# EAGLE design CrackberryPi_1.0.6.3 (EAGLE 7.2.0)
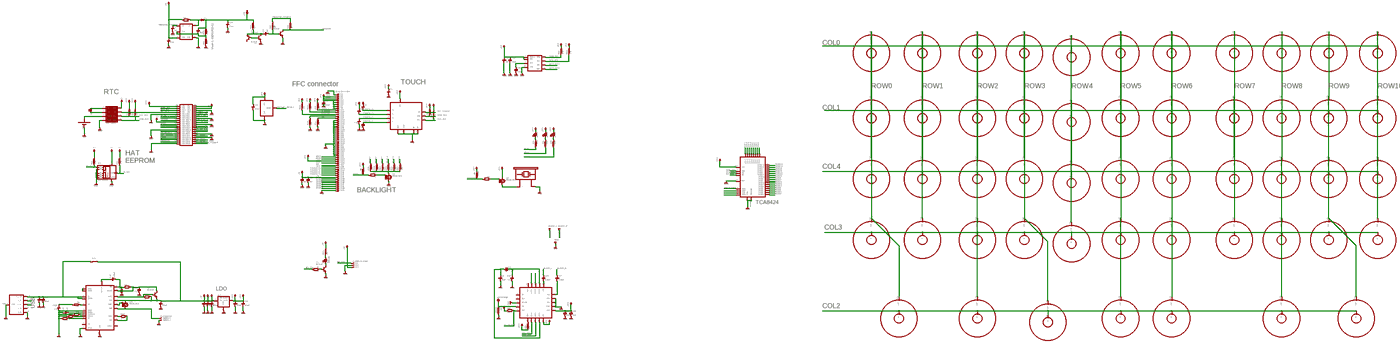
[diagram p0: schematic, sheet 1, overview]
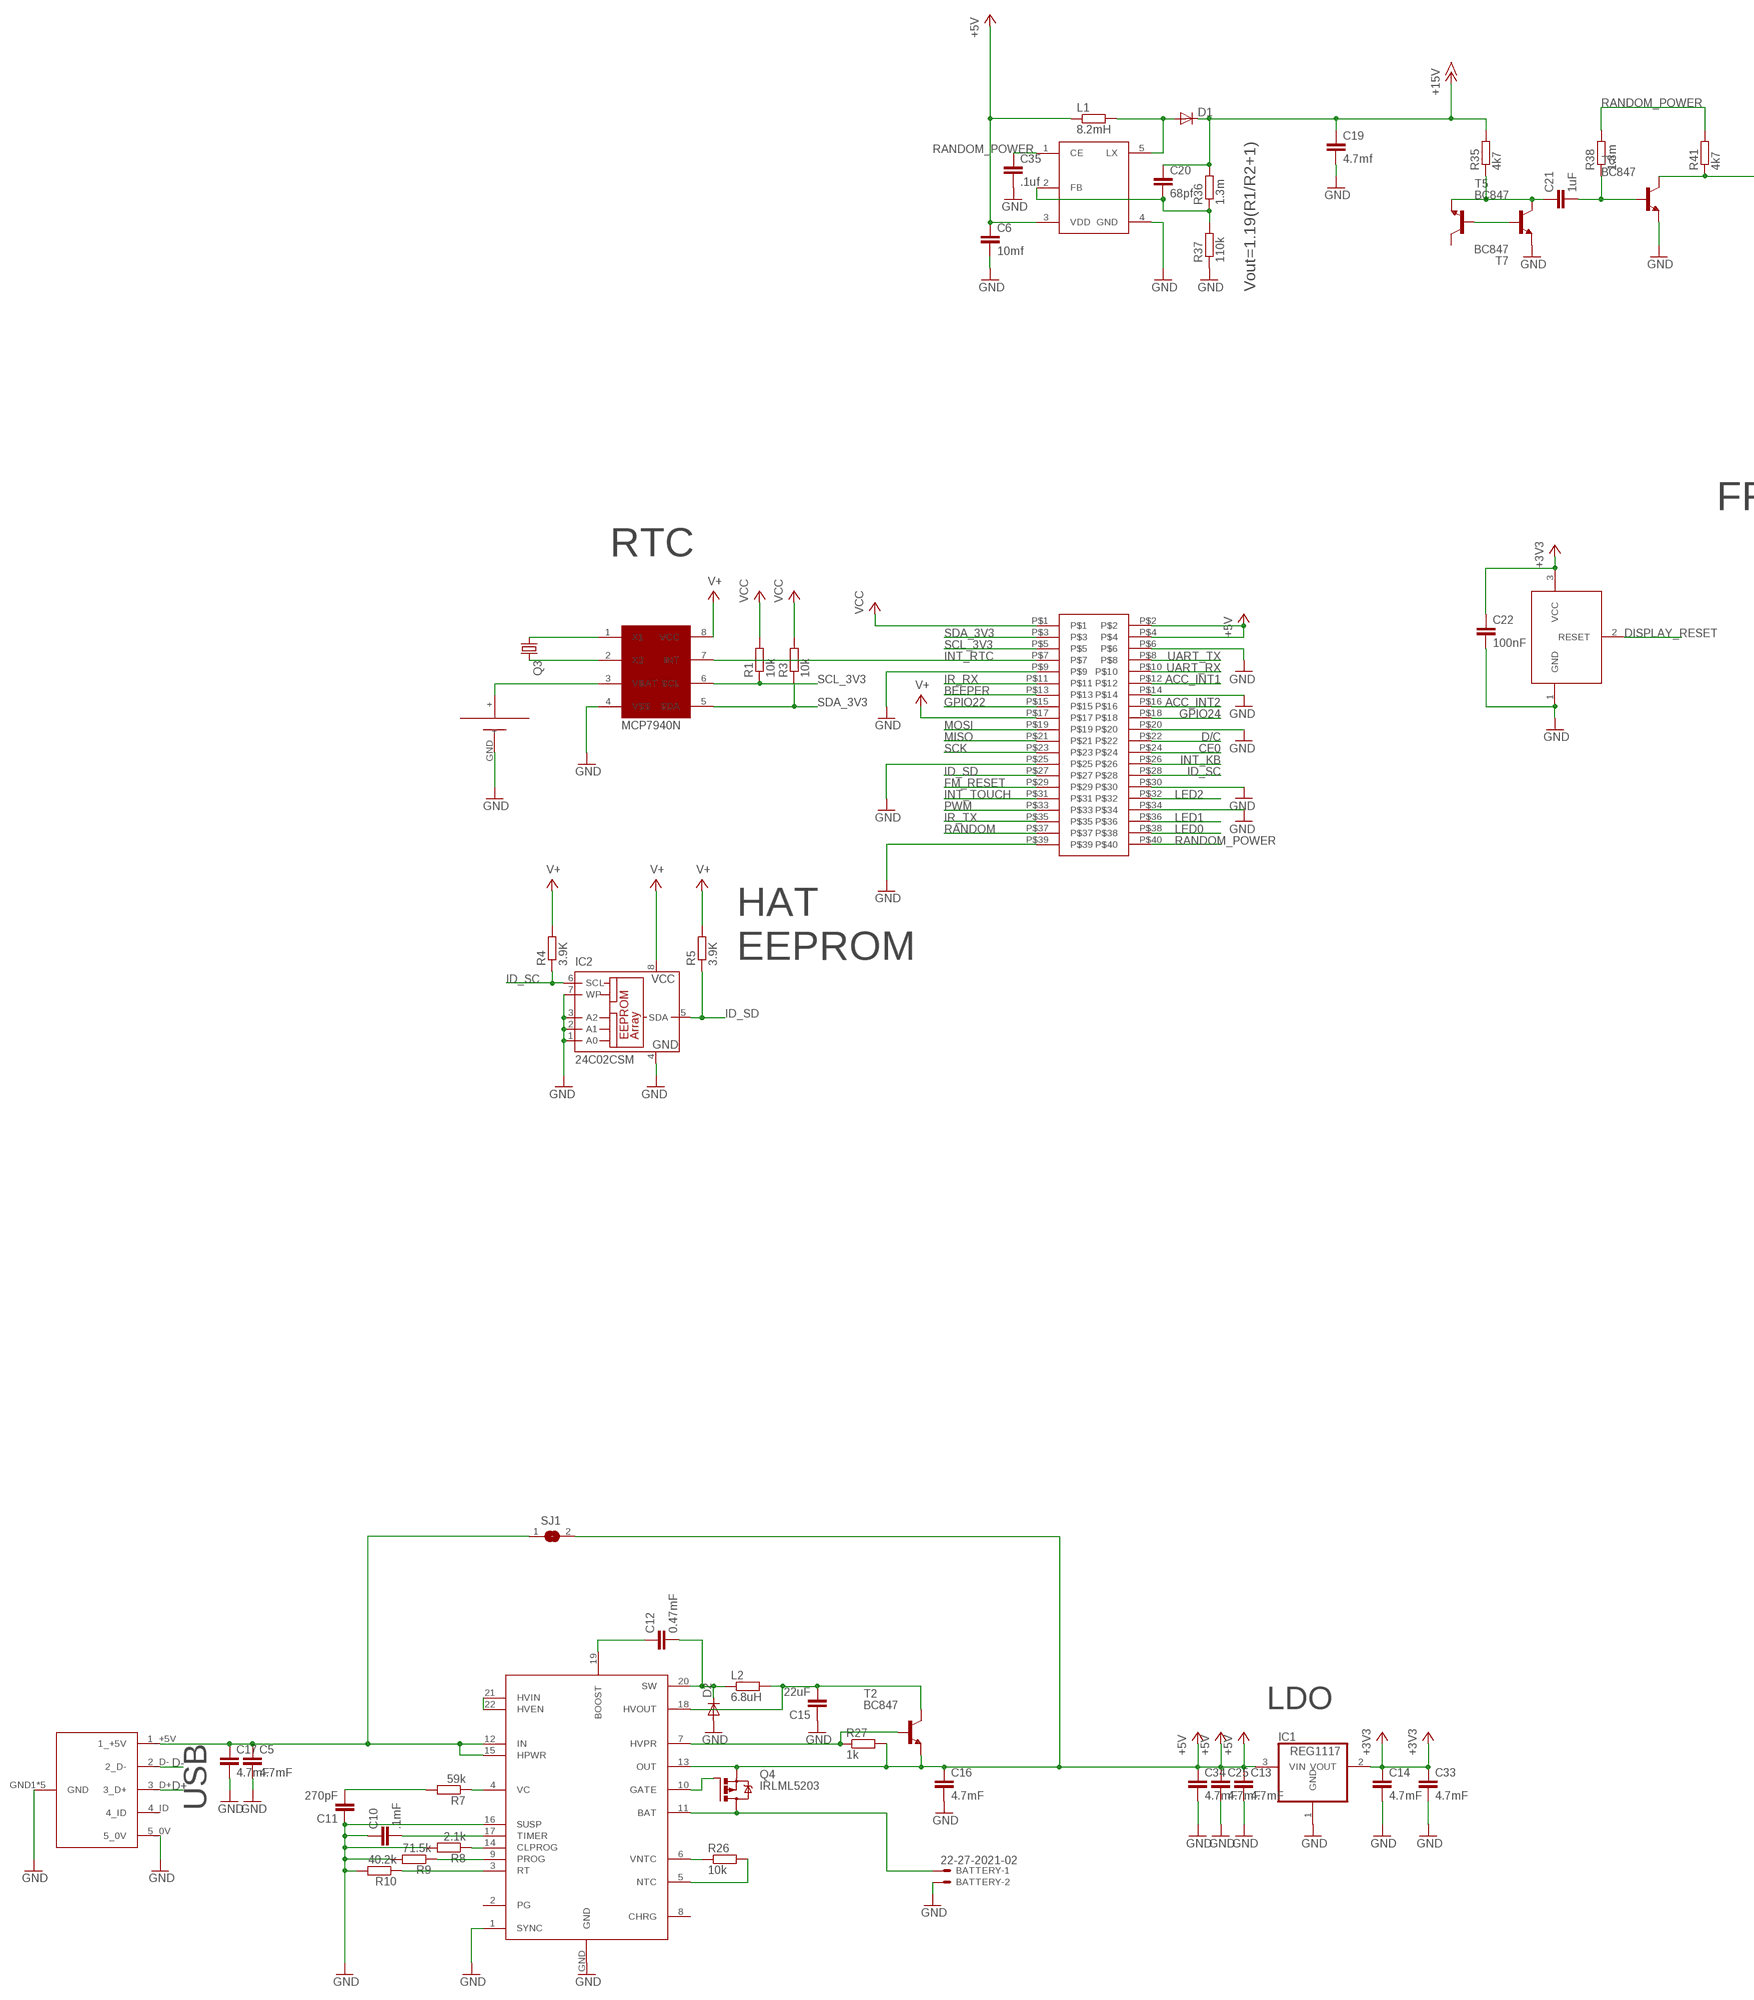
[diagram p1: schematic, sheet 1, part 1 of 4]
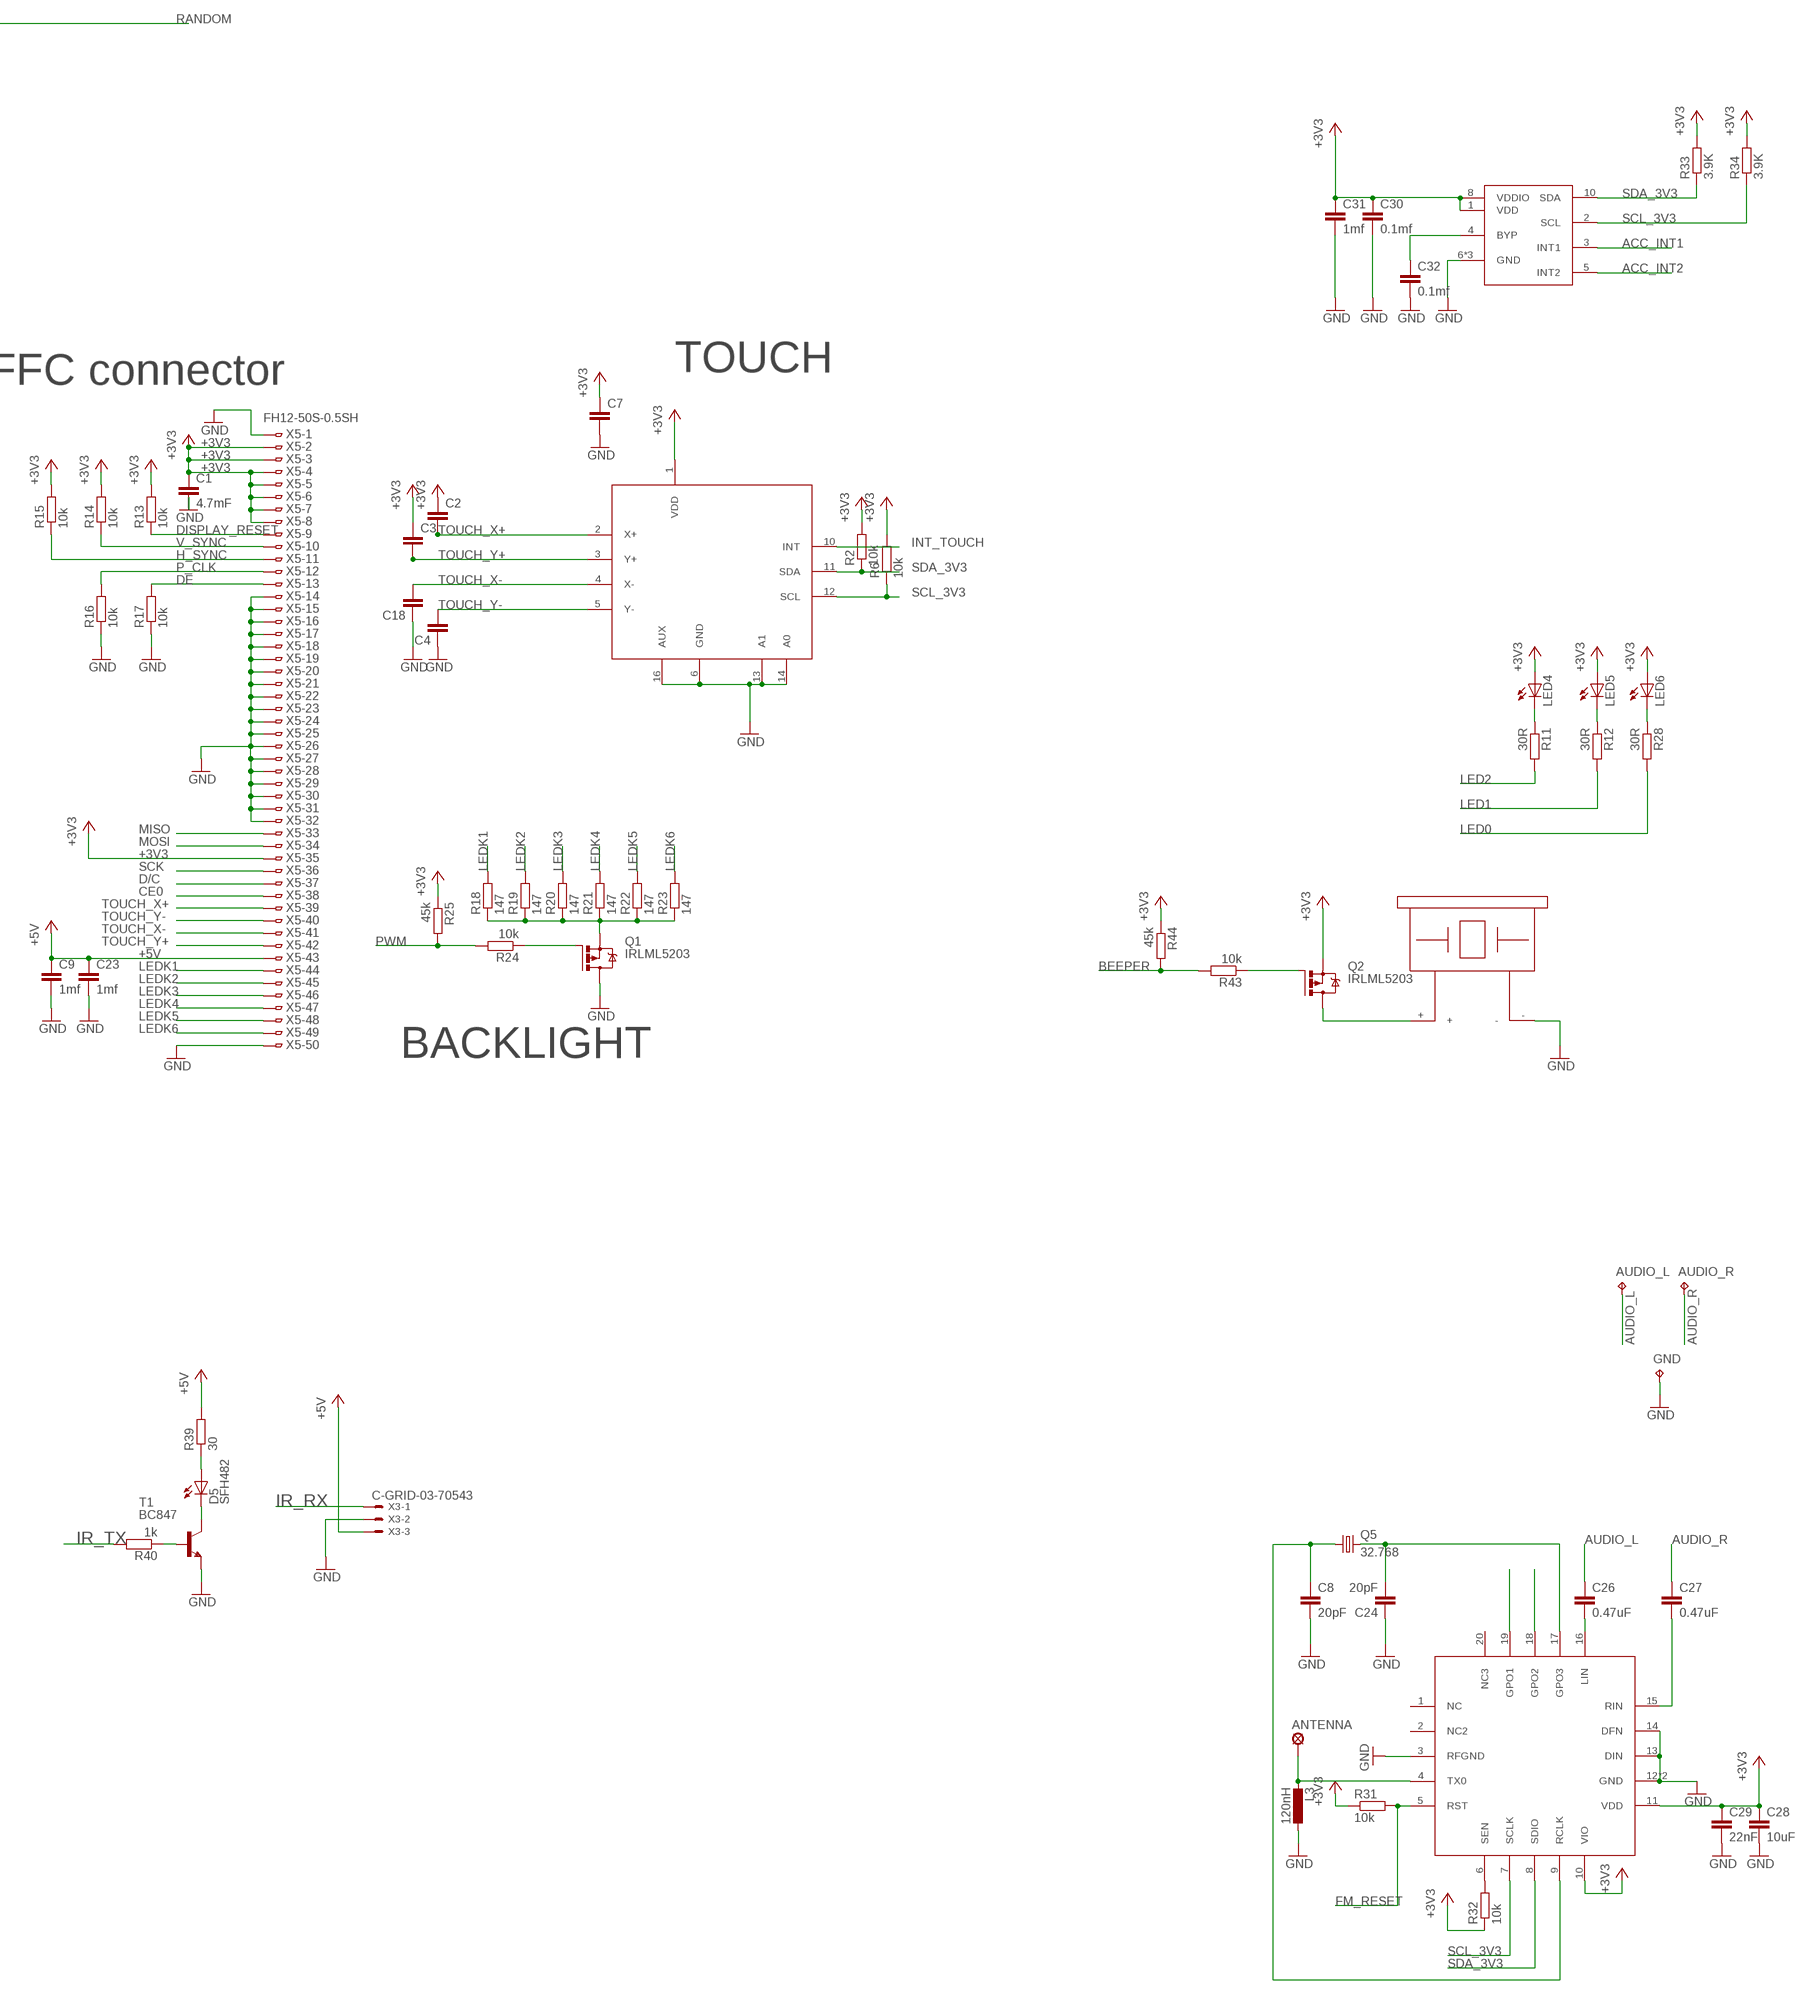
[diagram p2: schematic, sheet 1, part 2 of 4]
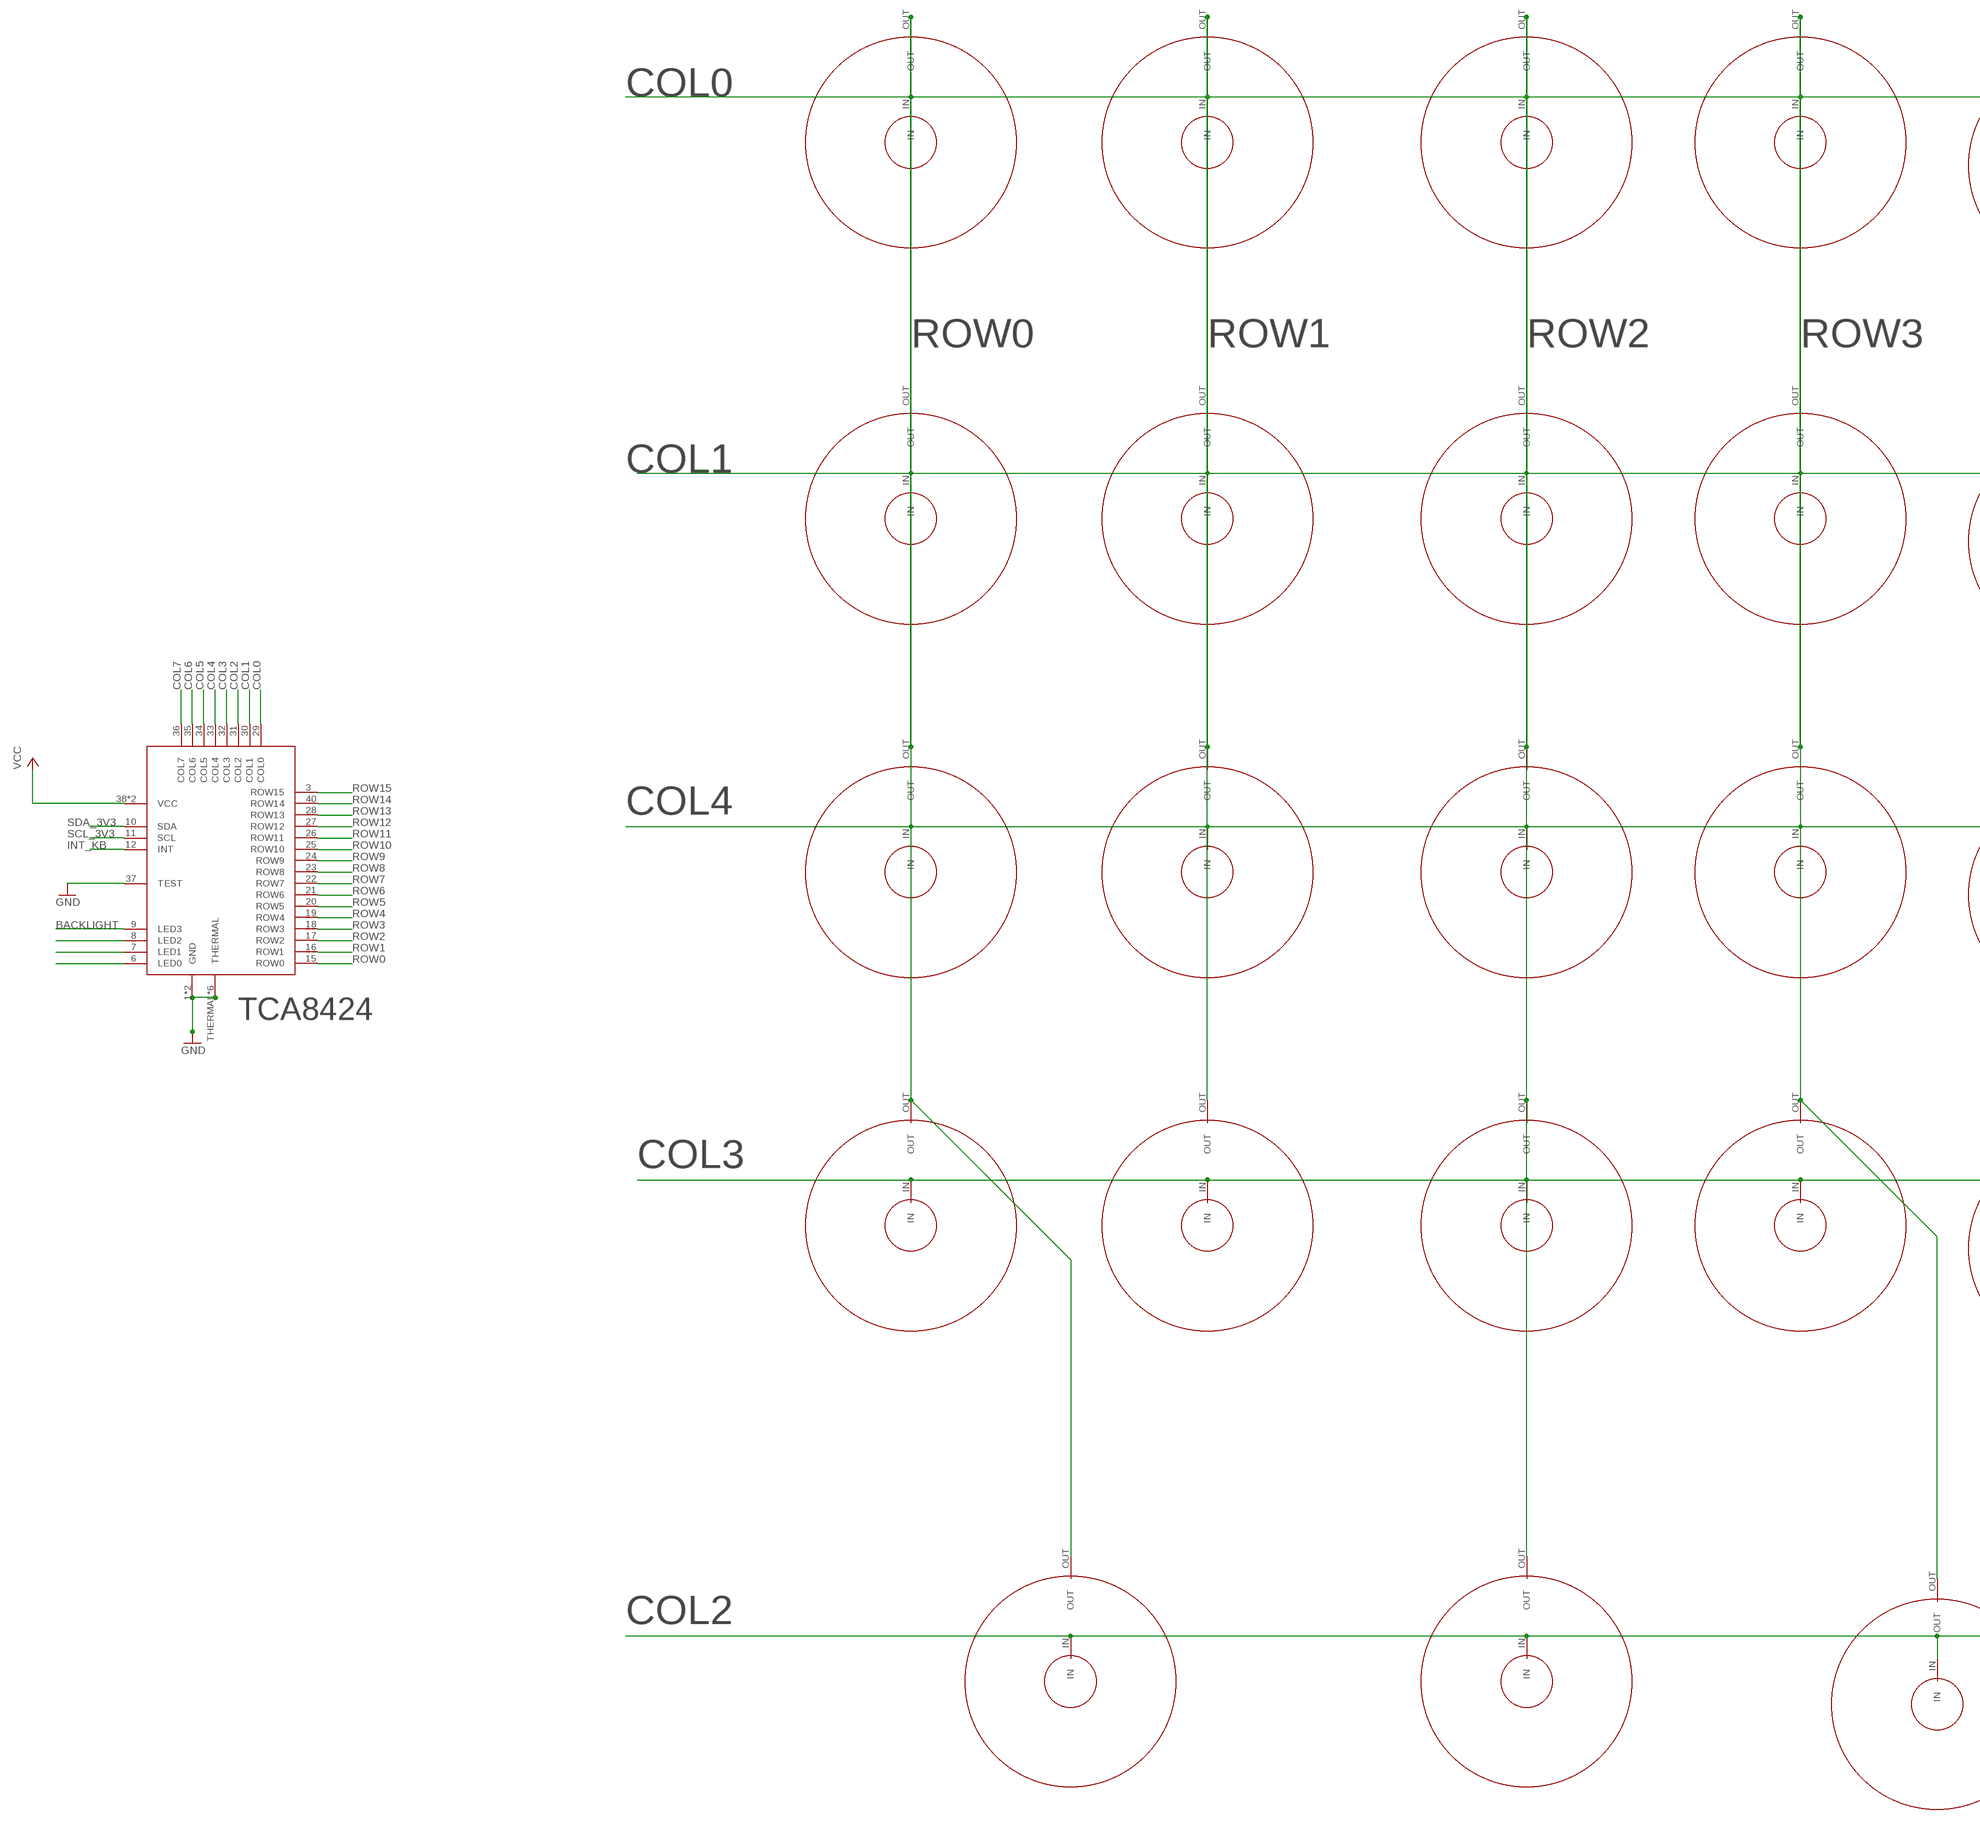
[diagram p3: schematic, sheet 1, part 3 of 4]
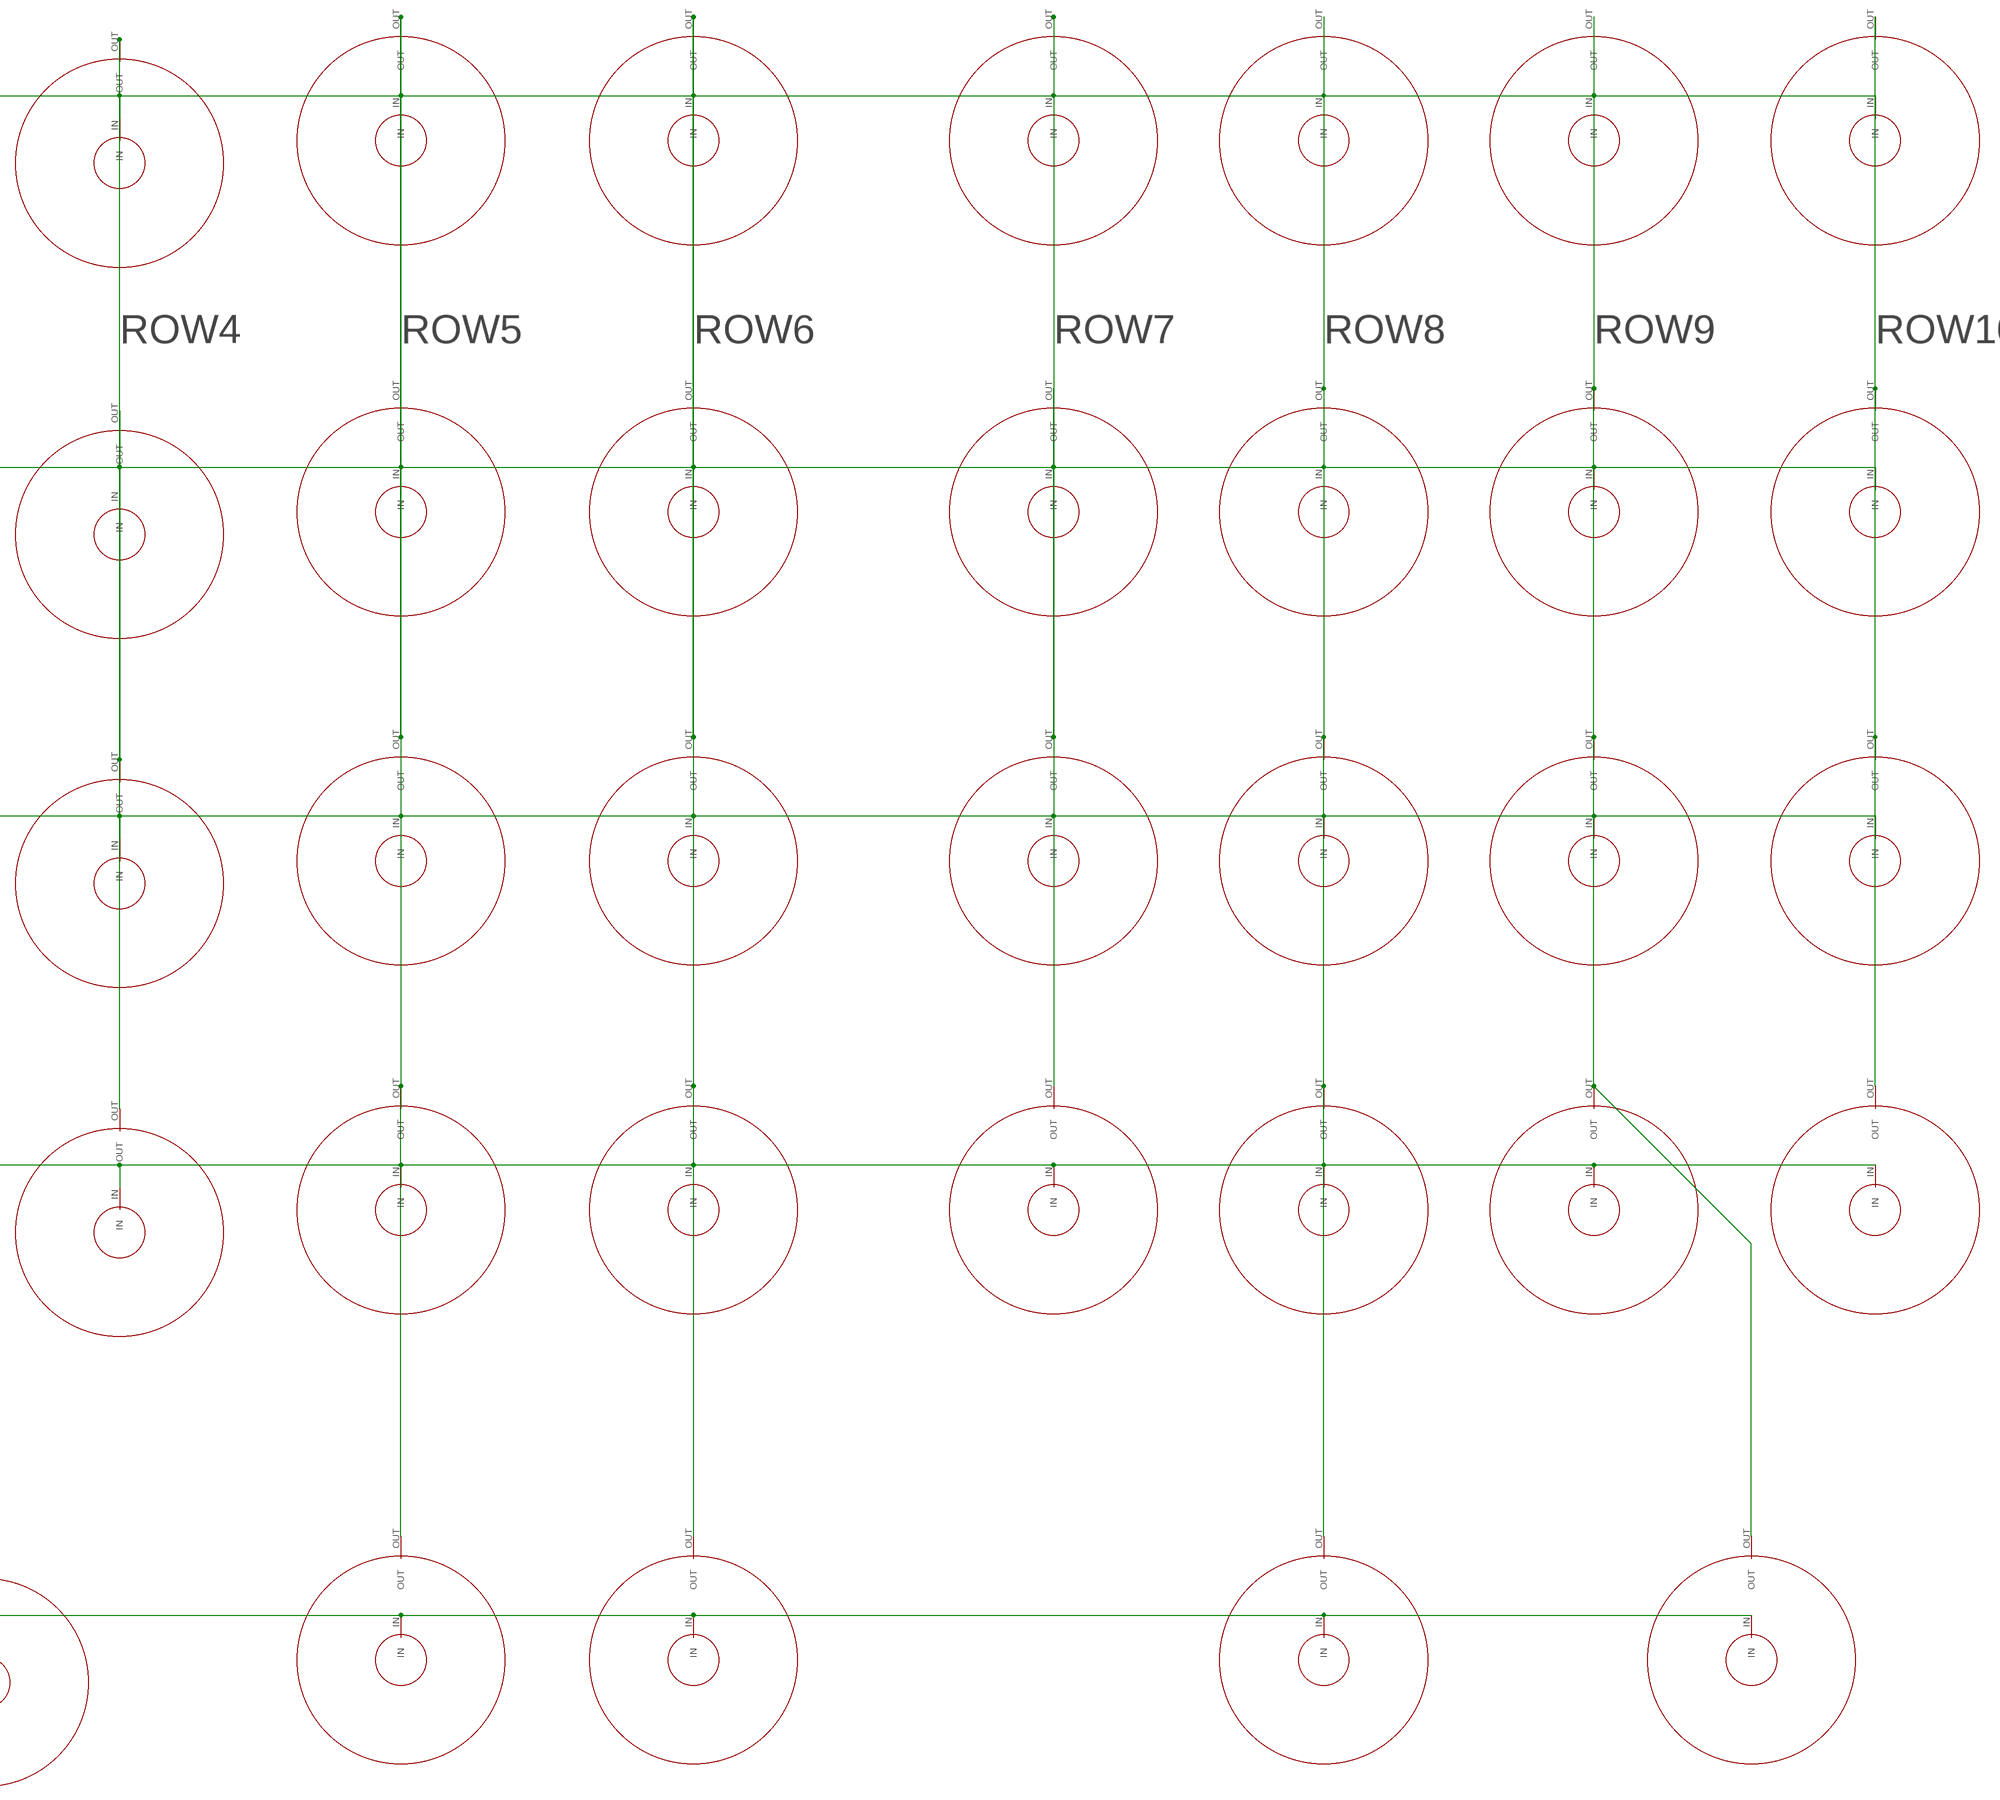
[diagram p4: schematic, sheet 1, part 4 of 4]

## Parts
1  DOME  [4MM]
2  DOME  [4MM]
3  DOME  [4MM]
4  DOME  [4MM]
5  DOME  [4MM]
6  DOME  [4MM]
7  DOME  [4MM]
8  DOME  [4MM]
9  DOME  [4MM]
10  DOME  [4MM]
11  DOME  [4MM]
12  DOME  [4MM]
!  DOME  [4MM]
(  DOME  [4MM]
)  DOME  [4MM]
,  DOME  [4MM]
.  DOME  [4MM]
?  DOME  [4MM]
@  DOME  [4MM]
A  DOME  [4MM]
ANTENNA  LSP10  [LSP10]
AUDIO_L  TPB2,54  [B2,54]
AUDIO_R  TPB2,54  [B2,54]
B  DOME  [4MM]
BATTERY  22-27-2021-02  [6410-02]
C  DOME  [4MM]
C1  4.7mF  C-EUC0603  [C0603]
C2  C-EUC0603  [C0603]
C3  C-EUC0603  [C0603]
C4  C-EUC0603  [C0603]
C5  4.7mF  C-EUC0603  [C0603]
C6  10mf  C-EUC0603  [C0603]
C7  C-EUC0603  [C0603]
C8  20pF  C-EUC0603  [C0603]
C9  1mf  C-EUC0603  [C0603]
C10  .1mF  C-EUC0603  [C0603]
C11  270pF  C-EUC0603  [C0603]
C12  0.47mF  C-EUC0603  [C0603]
C13  4.7mF  C-EUC0603  [C0603]
C14  4.7mF  C-EUC0603  [C0603]
C15  22uF  C-EUC1206  [C1206]
C16  4.7mF  C-EUC0603  [C0603]
C17  4.7mF  C-EUC0603  [C0603]
C18  C-EUC0603  [C0603]
C19  4.7mf  C-EUC0603  [C0603]
C20  68pf  C-EUC0603  [C0603]
C21  1uF  C-EUC0603  [C0603]
C22  100nF  C-EUC0603  [C0603]
C23  1mf  C-EUC0603  [C0603]
C24  20pF  C-EUC0603  [C0603]
C25  4.7mF  C-EUC0603  [C0603]
C26  0.47uF  C-EUC0603  [C0603]
C27  0.47uF  C-EUC0603  [C0603]
C28  10uF  C-EUC0603  [C0603]
C29  22nF  C-EUC0603  [C0603]
C30  0.1mf  C-EUC0603  [C0603]
C31  1mf  C-EUC0603  [C0603]
C32  0.1mf  C-EUC0603  [C0603]
C33  4.7mF  C-EUC0603  [C0603]
C34  4.7mF  C-EUC0603  [C0603]
C35  .1uf  C-EUC0603  [C0603]
D  DOME  [4MM]
D1  DIODE-SOD123  [SOD123]
D2  DIODE-SOD123  [SOD123]
D5  SFH482  [SFH482]
E  DOME  [4MM]
F  DOME  [4MM]
FN-RIGHT  DOME  [4MM]
G  DOME  [4MM]
GND  TPB2,54  [B2,54]
H  DOME  [4MM]
I  DOME  [4MM]
IC1  REG1117  [SOT223]
IC2  24C02CSM  [SO-08M]
J  DOME  [4MM]
K  DOME  [4MM]
L  DOME  [4MM]
L1  8.2mH  R-EU_R0805  [R0805]
L2  6.8uH  R-EU_R2010  [R2010]
L3  120nH  L-EUL2012C  [L2012C]
LED4  LED3MM  [LED3MM]
LED5  LED3MM  [LED3MM]
LED6  LED3MM  [LED3MM]
M  DOME  [4MM]
N  DOME  [4MM]
O  DOME  [4MM]
P  DOME  [4MM]
Q  DOME  [4MM]
Q1  IRLML5203  [MICRO3]
Q2  IRLML5203  [MICRO3]
Q3  CRYSTALMM20SS  [MM20SS]
Q4  IRLML5203  [MICRO3]
Q5  32.768  CRYSTALMM20SS  [MM20SS]
R  DOME  [4MM]
R1  10k  R-EU_R0603  [R0603]
R2  10k  R-EU_R0603  [R0603]
R3  10k  R-EU_R0603  [R0603]
R4  3.9K  R-EU_R0603  [R0603]
R5  3.9K  R-EU_R0603  [R0603]
R6  10k  R-EU_R0603  [R0603]
R7  59k  R-EU_R0603  [R0603]
R8  2.1k  R-EU_R0603  [R0603]
R9  71.5k  R-EU_R0603  [R0603]
R10  40.2k  R-EU_R0603  [R0603]
R11  30R  R-EU_R0603  [R0603]
R12  30R  R-EU_R0603  [R0603]
R13  10k  R-EU_R0603  [R0603]
R14  10k  R-EU_R0603  [R0603]
R15  10k  R-EU_R0603  [R0603]
R16  10k  R-EU_R0603  [R0603]
R17  10k  R-EU_R0603  [R0603]
R18  147  R-EU_R0603  [R0603]
R19  147  R-EU_R0603  [R0603]
R20  147  R-EU_R0603  [R0603]
R21  147  R-EU_R0603  [R0603]
R22  147  R-EU_R0603  [R0603]
R23  147  R-EU_R0603  [R0603]
R24  10k  R-EU_R0603  [R0603]
R25  45k  R-EU_R0603  [R0603]
R26  10k  R-EU_R0603  [R0603]
R27  1k  R-EU_R0603  [R0603]
R28  30R  R-EU_R0603  [R0603]
R31  10k  R-EU_R0603  [R0603]
R32  10k  R-EU_R0603  [R0603]
R33  3.9K  R-EU_R0603  [R0603]
R34  3.9K  R-EU_R0603  [R0603]
R35  4k7  R-EU_R0603  [R0603]
R36  1.3m  R-EU_R0603  [R0603]
R37  110k  R-EU_R0603  [R0603]
R38  1.3m  R-EU_R0603  [R0603]
R39  30  R-EU_R0603  [R0603]
R40  1k  R-EU_R0603  [R0603]
R41  4k7  R-EU_R0603  [R0603]
R43  10k  R-EU_R0603  [R0603]
R44  45k  R-EU_R0603  [R0603]
S  DOME  [4MM]
SHIFT-RIGHT  DOME  [4MM]
SHILFT-LEFT  DOME  [4MM]
SJ1  SJ  [SJ]
SPACE1  DOME  [4MM]
SPACE2  DOME  [4MM]
SPACE3  DOME  [4MM]
T  DOME  [4MM]
T1  BC847  [SOT23]
T2  BC847  [SOT23]
T5  BC847  [SOT23]
T6  BC847  [SOT23]
T7  BC847  [SOT23]
U  DOME  [4MM]
U$1  LTC4090  [DFN22]
U$2  NCP1406  [SOT23-5L]
U$3  RESETMONITOR  [SOT23]
U$4  CR1216  [CR1216]
U$5  MCP7940N  [SO08]
U$6  TSC2007  [TSSOP16]
U$7  TCA8424  [QFN40]
U$8  AT1220  [12X6.5]
U$9  MICRO_USB  [MICRO_USB]
U$11  HEADER  [20X2]
U$12  SI4713  [QFN20-3X3]
U$13  ACCELLEROMETER  [DFN-10_2X2]
V  DOME  [4MM]
W  DOME  [4MM]
X  DOME  [4MM]
X3  C-GRID-03-70543  [70543-03]
X5  FH12-50S-0.5SH  [FH12-50S-0.5SH]
Y  DOME  [4MM]
Z  DOME  [4MM]

## Nets
+3V3: C1.1 C2.1 C3.1 C7.1 C14.1 C22.1 C28.1 C29.1 C30.1 C31.1 C33.1 IC1.2(VOUT) LED4.A LED5.A LED6.A Q2.2(S) R2.2 R6.2 R13.2 R14.2 R15.2 R25.1 R31.1 R32.1 R33.2 R34.2 R44.1 U$3.3(VCC) U$6.1(VDD) U$12.10(VIO) U$12.11(VDD) U$13.1(VDD) U$13.8(VDDIO) X5.2 X5.3 X5.4 X5.5 X5.6 X5.7 X5.8 X5.35
+5V: C6.1 C9.1 C13.1 C16.1 C23.1 C25.1 C34.1 IC1.3(VIN) L1.1 Q4.2(S) R27.2 R39.2 SJ1.2 T2.2(E) U$1.13(OUT) U$2.3(VDD) U$11.P$2 U$11.P$4 X3.3 X5.43
+15V: C19.1 C20.1 D1.C R35.2 R36.2
ACC_INT1: U$11.P$12 U$13.3(INT1)
ACC_INT2: U$11.P$16 U$13.5(INT2)
AUDIO_L: AUDIO_L.TP C26.1
AUDIO_R: AUDIO_R.TP C27.1
BACKLIGHT: U$7.9(LED3)
BASE: R40.1 T1.1(B)
BAT: BATTERY.1 Q4.3(D) U$1.11(BAT)
BEEPER: R43.2 R44.2 U$11.P$13
BOOST: C12.1 U$1.19(BOOST)
CE0: U$11.P$24 X5.38
COL0: 1.IN 2.IN 3.IN 4.IN 5.IN 6.IN 7.IN 8.IN 9.IN 10.IN 11.IN U$7.29(COL0)
COL1: 12.IN E.IN I.IN O.IN P.IN Q.IN R.IN T.IN U$7.30(COL1) U.IN W.IN Y.IN
COL2: @.IN FN-RIGHT.IN SHIFT-RIGHT.IN SHILFT-LEFT.IN SPACE1.IN SPACE2.IN SPACE3.IN U$7.31(COL2)
COL3: !.IN ,.IN ..IN ?.IN B.IN C.IN M.IN N.IN U$7.32(COL3) V.IN X.IN Z.IN
COL4: (.IN ).IN A.IN D.IN F.IN G.IN H.IN J.IN K.IN L.IN S.IN U$7.33(COL4)
COL5: U$7.34(COL5)
COL6: U$7.35(COL6)
COL7: U$7.36(COL7)
COLLECTOR: D5.K(C) T1.3(C)
D+: U$9.3_D+
D-: U$9.2_D-
D/C: U$11.P$22 X5.37
DE: R17.2 X5.13
DISPLAY_RESET: R13.1 U$3.2(RESET) X5.9
FB: C20.2 R36.1 R37.2 U$2.2(FB)
FM_RESET: R31.2 U$11.P$29 U$12.5(RST)
GND: BATTERY.2 C1.2 C4.1 C5.2 C6.2 C7.2 C8.2 C9.2 C10.1 C11.1 C13.2 C14.2 C15.1 C16.2 C17.2 C18.1 C19.2 C22.2 C23.2 C24.1 C25.2 C28.2 C29.2 C30.2 C31.2 C32.2 C33.2 C34.2 C35.2 D2.A GND.TP IC1.1(GND) IC2.1(A0) IC2.2(A1) IC2.3(A2) IC2.4(GND) IC2.7(WP) L3.1 Q1.3(D) R8.2 R9.2 R10.2 R16.1 R17.1 R37.1 T1.2(E) T5.2(E) T6.2(E) U$1.1(SYNC) U$1.16(SUSP) U$1.GND U$2.4(GND) U$3.1(GND) U$4.GND(-) U$5.4(VSS) U$6.6(GND) U$6.13(A1) U$6.14(A0) U$6.16(AUX) U$7.1(GND) U$7.4(GND) U$7.37(TEST) U$7.THERMAL U$7.VIA1(THERMAL) U$7.VIA2(THERMAL) U$7.VIA3(THERMAL) U$7.VIA4(THERMAL) U$7.VIA5(THERMAL) U$8.- U$9.5_0V U$9.GND1(GND) U$9.GND2(GND) U$9.GND5(GND) U$9.P$1(GND) U$9.P$7(GND) U$11.P$6 U$11.P$9 U$11.P$14 U$11.P$20 U$11.P$25 U$11.P$30 U$11.P$34 U$11.P$39 U$12.3(RFGND) U$12.12(GND) U$12.13(DIN) U$12.14(DFN) U$12.P$1(GND) U$13.6(GND) U$13.7(GND) U$13.9(GND) X3.2 X5.1 X5.14 X5.15 X5.16 X5.17 X5.18 X5.19 X5.20 X5.21 X5.22 X5.23 X5.24 X5.25 X5.26 X5.27 X5.28 X5.29 X5.30 X5.31 X5.32 X5.50
GPIO22: U$11.P$15
GPIO24: U$11.P$18
GPO1: U$12.19(GPO1)
GPO2: U$12.18(GPO2)
H_SYNC: R15.1 X5.11
HVOUT: C15.2 L2.2 T2.3(C) U$1.18(HVOUT)
HVPR: R27.1 T2.1(B) U$1.7(HVPR)
ID_SC: IC2.6(SCL) R4.1 U$11.P$28
ID_SD: IC2.5(SDA) R5.1 U$11.P$27
IN: C5.1 C17.1 SJ1.1 U$1.12(IN) U$1.15(HPWR) U$9.1_+5V
INT_KB: U$7.12(INT) U$11.P$26
INT_RTC: U$5.7(INT) U$11.P$7
INT_TOUCH: U$6.10(INT) U$11.P$31
IR_RX: U$11.P$11 X3.1
IR_TX: R40.2 U$11.P$35
LED0: R28.2 U$11.P$38
LED1: R12.2 U$11.P$36
LED2: R11.2 U$11.P$32
LEDK1: R18.2 X5.44
LEDK2: R19.2 X5.45
LEDK3: R20.2 X5.46
LEDK4: R21.2 X5.47
LEDK5: R22.2 X5.48
LEDK6: R23.2 X5.49
LX: D1.A L1.2 U$2.5(LX)
MISO: U$11.P$21 X5.33
MOSI: U$11.P$19 X5.34
N$1: Q3.4 U$5.2(X2)
N$2: Q3.1 U$5.1(X1)
N$3: R9.1 U$1.9(PROG)
N$4: R10.1 U$1.3(RT)
N$5: R8.1 U$1.14(CLPROG)
N$6: R7.1 U$1.4(VC)
N$7: C10.2 U$1.17(TIMER)
N$8: C11.2 R7.2
N$9: U$1.21(HVIN) U$1.22(HVEN)
N$10: U$7.6(LED0)
N$11: LED4.K(C) R11.1
N$12: Q1.2(S) R18.1 R19.1 R20.1 R21.1 R22.1 R23.1
N$13: Q2.1(G) R43.1
N$14: U$7.7(LED1)
N$15: C8.1 Q5.1 U$12.9(RCLK)
N$16: T5.1(B) T7.1(B)
N$17: Q2.3(D) U$8.+
N$18: U$7.8(LED2)
N$19: C24.2 Q5.4 U$12.17(GPO3)
N$20: Q1.1(G) R24.1
N$21: R26.1 U$1.6(VNTC)
N$22: LED5.K(C) R12.1
N$23: C26.2 U$12.16(LIN)
N$24: LED6.K(C) R28.1
N$25: C27.2 U$12.15(RIN)
N$26: ANTENNA.MP L3.2 U$12.4(TX0)
N$27: R26.2 U$1.5(NTC)
N$28: C21.1 R35.1 T5.3(C) T7.2(E)
N$29: R32.2 U$12.6(SEN)
N$30: D5.A R39.1
N$31: C32.1 U$13.4(BYP)
N$32: C21.2 R38.1 T6.1(B)
N$33: Q4.1(G) U$1.10(GATE)
P_CLK: R16.2 X5.12
PWM: R24.2 R25.2 U$11.P$33
RANDOM: R41.1 T6.3(C) U$11.P$37
RANDOM_POWER: C35.1 R38.2 R41.2 U$2.1(CE) U$11.P$40
ROW0: 1.OUT A.OUT Q.OUT SHILFT-LEFT.OUT U$7.15(ROW0) Z.OUT
ROW1: 2.OUT S.OUT U$7.16(ROW1) W.OUT X.OUT
ROW2: 3.OUT C.OUT D.OUT E.OUT SPACE1.OUT U$7.17(ROW2)
ROW3: 4.OUT F.OUT R.OUT SPACE2.OUT U$7.18(ROW3) V.OUT
ROW4: 5.OUT B.OUT G.OUT T.OUT U$7.19(ROW4)
ROW5: 6.OUT H.OUT N.OUT SPACE3.OUT U$7.20(ROW5) Y.OUT
ROW6: 7.OUT J.OUT M.OUT SHIFT-RIGHT.OUT U$7.21(ROW6) U.OUT
ROW7: 8.OUT ?.OUT I.OUT K.OUT U$7.22(ROW7)
ROW8: 9.OUT !.OUT @.OUT L.OUT O.OUT U$7.23(ROW8)
ROW9: 10.OUT (.OUT ,.OUT FN-RIGHT.OUT P.OUT U$7.24(ROW9)
ROW10: 11.OUT 12.OUT ).OUT ..OUT U$7.25(ROW10)
ROW11: U$7.26(ROW11)
ROW12: U$7.27(ROW12)
ROW13: U$7.28(ROW13)
ROW14: U$7.40(ROW14)
ROW15: U$7.3(ROW15)
SCK: U$11.P$23 X5.36
SCL_3V3: R1.1 R6.1 R34.1 U$5.6(SCL) U$6.12(SCL) U$7.11(SCL) U$11.P$5 U$12.7(SCLK) U$13.2(SCL)
SDA_3V3: R2.1 R3.1 R33.1 U$5.5(SDA) U$6.11(SDA) U$7.10(SDA) U$11.P$3 U$12.8(SDIO) U$13.10(SDA)
SW: C12.2 D2.C L2.1 U$1.20(SW)
TOUCH_X+: C2.2 U$6.2(X+) X5.39
TOUCH_X-: C18.2 U$6.4(X-) X5.41
TOUCH_Y+: C3.2 U$6.3(Y+) X5.42
TOUCH_Y-: C4.2 U$6.5(Y-) X5.40
UART_RX: U$11.P$10
UART_TX: U$11.P$8
V+: IC2.8(VCC) R4.2 R5.2 U$5.8(VCC) U$11.P$17
V_SYNC: R14.1 X5.10
VBAT+: U$4.+ U$5.3(VBAT)
VCC: R1.2 R3.2 U$7.38(VCC) U$7.39(VCC) U$11.P$1
Unconnected: T7.3(C) U$1.2(PG) U$1.8(CHRG) U$9.4_ID U$12.1(NC) U$12.2(NC2) U$12.20(NC3)

## Notes on the sheet
- Vout=1.19(R1/R2+1)
- FFC connector | TOUCH
- RTC
- MCP7940N
- HAT
  EEPROM
- BACKLIGHT
- TCA8424
- LDO
- USB

## Library data of the parts
1-12 ! ( ) , . ? @ A B C D E F FN-RIGHT G H I J K L M N O P Q R S SHIFT-RIGHT SHILFT-LEFT SPACE1-SPACE3 T U V W X Y Z = DOME:DOME
ANTENNA = solpad:LSP10: SOLDER PAD drill 1.0 mm, distributor Buerklin, 12H555
AUDIO_L AUDIO_R GND = testpad:TP: Test pad
BATTERY = con-molex:22-?-02: CONNECTOR wire to board 2.54 mm (.1 inch) pitch header; OC_FARNELL: unknown; OC_NEWARK: unknown
C1-C35 = rcl:C-EU: CAPACITOR, European symbol
D1 D2 = diode:DIODE-: DIODE
D5 = led:SFH482: IR LED infrared emitting diode, Infineon
IC1 = burr-brown:REG1117: 800mA and 1A Low Dropout (LDO) Positive Regulator 1.8V, 2.5V, 2.85V, 3.3V, 5V, and Adj; MPN: REG1117; OC_FARNELL: 1097566; OC_NEWARK: 14P6981
IC2 = microchip:24C*: Serial EEPROM 1 K/2 K/4 K; MF: MICROCHIP; MPN: 24C02C-I/SN; OC_FARNELL: 1084339; OC_NEWARK: 96K4063
L1 L2 R1-R28 R31-R41 R43 R44 = rcl:R-EU_: RESISTOR, European symbol
L3 = rcl:L-EU: INDUCTOR, European symbol
LED4-LED6 = led:LED: LED OSRAM: - CHIPLED LG R971, LG N971, LY N971, LG Q971, LY Q971, LO R971, LY R971 LH N974, LH R974 LS Q976, LO Q976, LY Q976 LO Q996 - Hyper CHIPLED LW Q18S LB Q993, LB Q99A, LB R99A - SideLED LS A670, LO A670, LY A670, LG A670, LP A670 LB A673, LV A673, LT A673, LW A673 LH A674 LY A675 LS A676, LA A676, LO A676, LY A676, LW A676 LS A679, LY A679, LG A679 - Hyper Micro SIDELED® LS Y876, LA Y876, LO Y876, LY Y876 LT Y87S - SmartLED LW L88C, LW L88S LB L89C, LB L89S, LG L890 LS L89K, LO L89K, LY L89K LS L896, LA L896, LO L896, LY L896 - TOPLED LS T670, LO T670, LY T670, LG T670, LP T670 LSG T670, LSP T670, LSY T670, LOP T670, LYG T670 LG T671, LOG T671, LSG T671 LB T673, LV T673, LT T673, LW T673 LH T674 LS T676, LA T676, LO T676, LY T676, LB T676, LH T676, LSB T676, LW T676 LB T67C, LV T67C, LT T67C, LS T67K, LO T67K, LY T67K, LW E67C LS E67B, LA E67B, LO E67B, LY E67B, LB E67C, LV E67C, LT E67C LW T67C LS T679, LY T679, LG T679 LS T770, LO T770, LY T770, LG T770, LP T770 LB T773, LV T773, LT T773, LW T773 LH T774 LS E675, LA E675, LY E675, LS T675 LS T776, LA T776, LO T776, LY T776, LB T776 LHGB T686 LT T68C, LB T68C - Hyper Mini TOPLED® LB M676 - Mini TOPLED Santana® LG M470 LS M47K, LO M47K, LY M47K Source: http://www.osram.convergy.de LUXEON: - LUMILED® LXK2-PW12-R00, LXK2-PW12-S00, LXK2-PW14-U00, LXK2-PW14-V00 LXK2-PM12-R00, LXK2-PM12-S00, LXK2-PM14-U00 LXK2-PE12-Q00, LXK2-PE12-R00, LXK2-PE12-S00, LXK2-PE14-T00, LXK2-PE14-U00 LXK2-PB12-K00, LXK2-PB12-L00, LXK2-PB12-M00, LXK2-PB14-N00, LXK2-PB14-P00, LXK2-PB14-Q00 LXK2-PR12-L00, LXK2-PR12-M00, LXK2-PR14-Q00, LXK2-PR14-R00 LXK2-PD12-Q00, LXK2-PD12-R00, LXK2-PD12-S00 LXK2-PH12-R00, LXK2-PH12-S00 LXK2-PL12-P00, LXK2-PL12-Q00, LXK2-PL12-R00 Source: www.luxeon.com KINGBRIGHT: KA-3528ASYC Source: www.kingbright.com
Q1 Q2 Q4 = transistor-power:IRLML5203: HEXFET P-Channel Power MOSFET
Q3 Q5 = crystal:CRYSTAL: CRYSTAL; OC_FARNELL: unknown; OC_NEWARK: unknown
SJ1 = jumper:SJ: SMD solder JUMPER
T1 T2 T5-T7 = transistor:BC847: NPN TRANSISTOR
U$1 = LTC4090:LTC4090
U$2 = ncp1406:NCP1406
U$3 = MAX803:RESETMONITOR
U$4 = cr1216:CR1216
U$5 = MCP7940N:MCP7940N
U$6 = tsc2046:TSC2007
U$7 = TCA8424:TCA8424
U$8 = AT1220:AT1220
U$9 = MICRO_USB:MICRO_USB
U$11 = 20x2_cirqoid:HEADER
U$12 = Si4713:SI4713
U$13 = MMA8653:ACCELLEROMETER
X3 = con-molex:C-GRID-03: CONNECTOR wire to board 2.54 mm (0.100") pitch header; OC_FARNELL: unknown; OC_NEWARK: unknown
X5 = FCI_62684:FH12-50S-0.5S: 0.5mm Pitch Connectors For FPC/FFC Source: Data sheet <http://www.hirose.co.jp/cataloge_hp/e58605370.pdf>; MPN: FH12-50S-0.5SH(55); OC_FARNELL: 1324557; OC_NEWARK: 34M6181

## Board
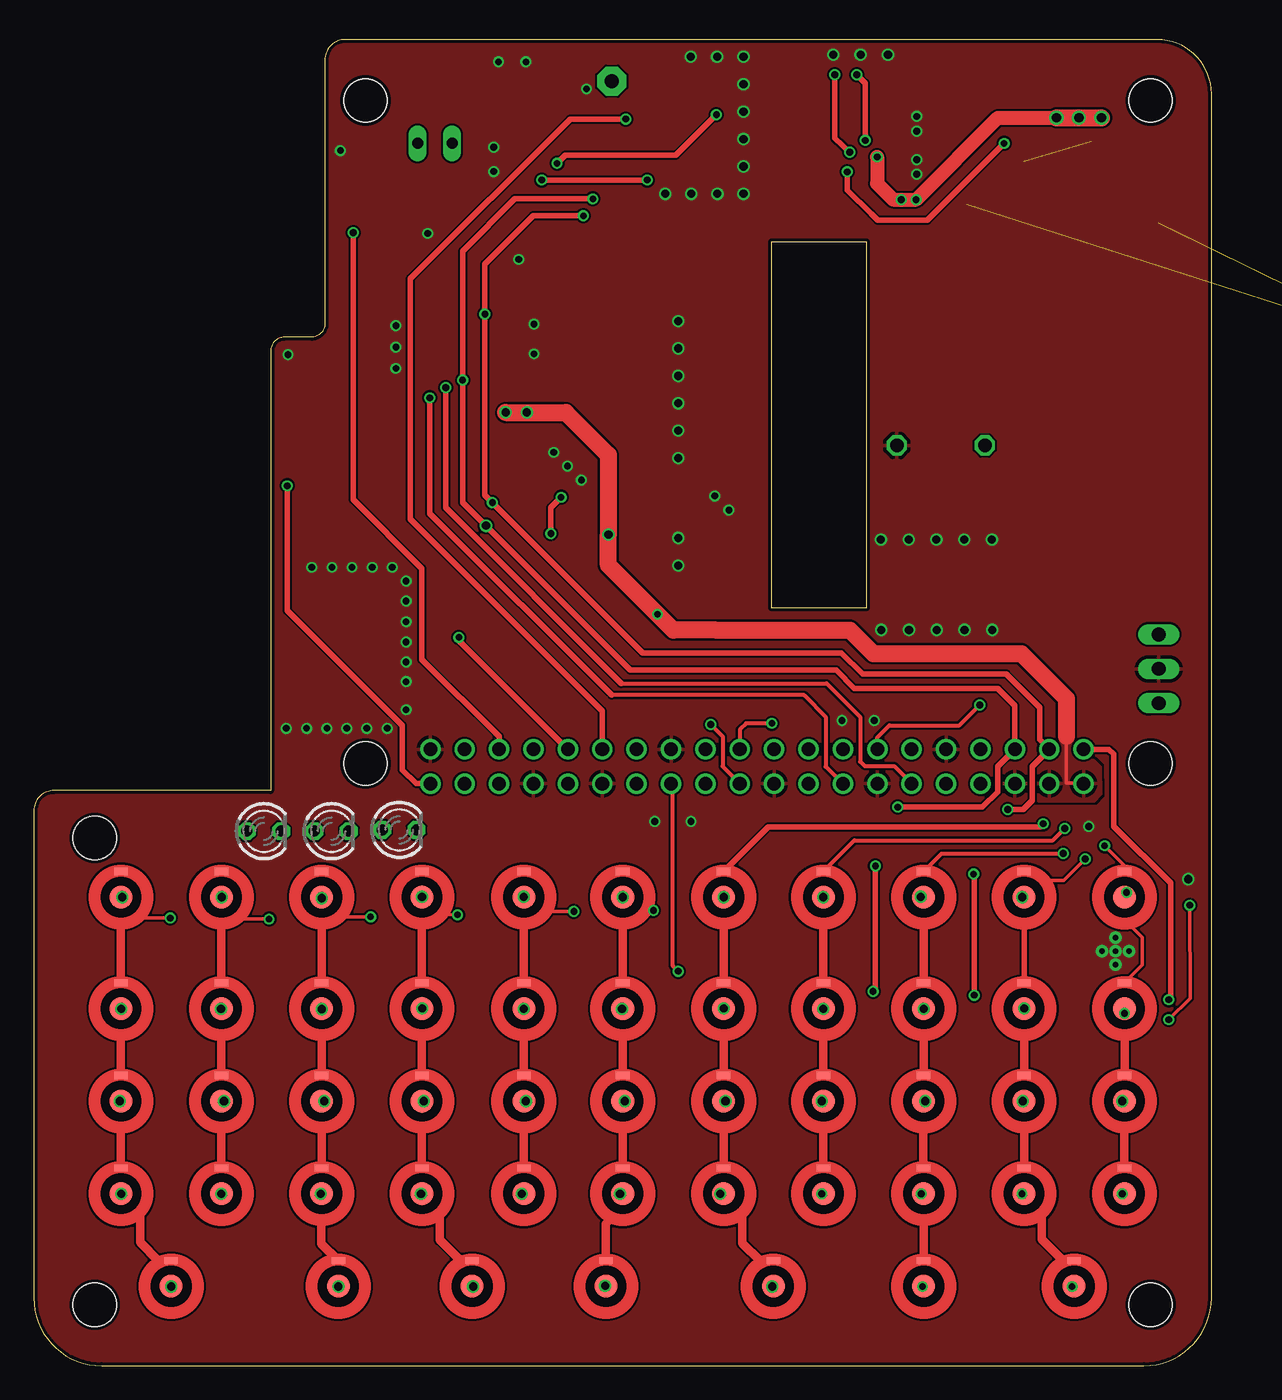
[diagram p5: board, top side]
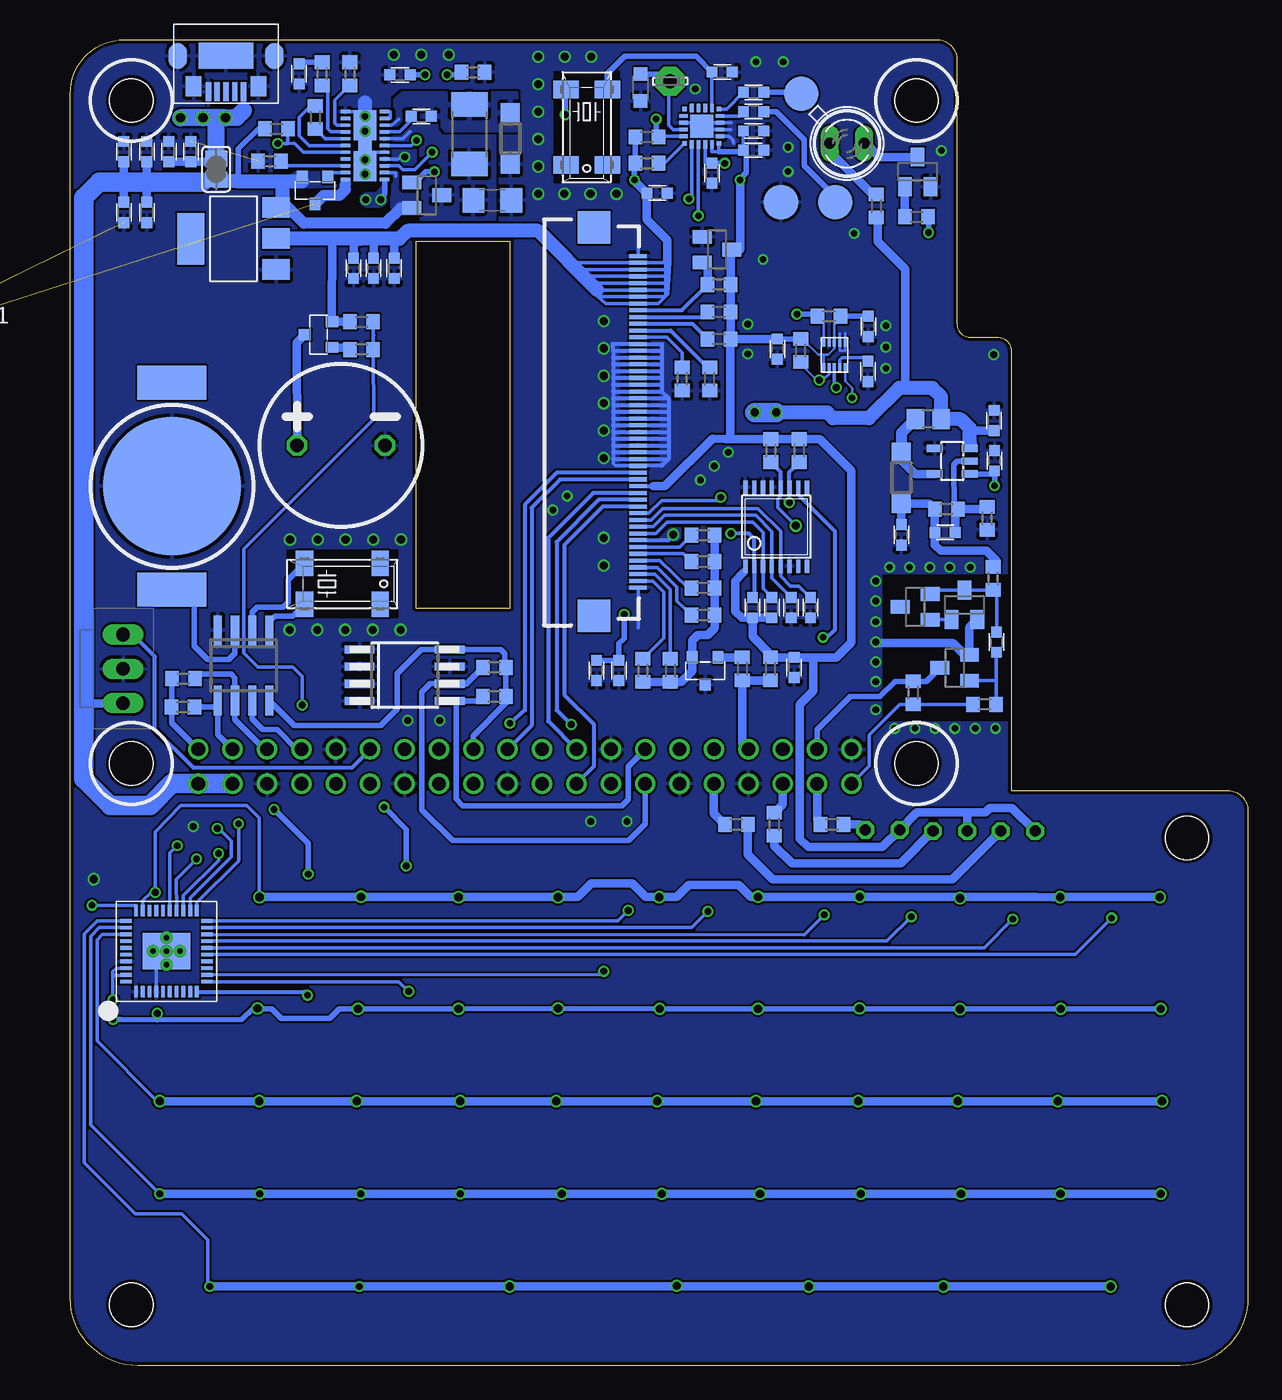
[diagram p6: board, bottom side, seen from below]

Size 87 x 98 mm. Coordinates in mm from the lower left corner, seen from the top.
Outline: 17.5,42.5 1.5,42.5 arc90 0,41 0,5 arc90 5,0 82,0 arc90 87,5 87,94 arc90 83,98 23,98 arc90 21.5,96.5 21.5,77 arc-90 20.5,76 18.5,76 arc90 17.5,75 17.5,42.5
Outline: 61.5,56 54.5,56 54.5,83.05 61.5,83.05 61.5,56
Copper layers (1*16): Top 0.035mm / dielectric 1.5mm / Bottom 0.035mm
Design rules "SeeedStudio_2layer_DRU_no_angle_20140221": minimum track width 6mil, minimum drill 12mil, track to track 6mil, track to pad 6mil, pad to pad 6mil, via to via 6mil, smd to smd 0mil, copper to edge 10mil, drill to drill 10mil, minimum pad ring 10mil, minimum via ring 6mil, stop-mask expansion 2mil, vias tented up to drill 100mil, thermal gap 10mil
Holes 3.2 mm at 82.5,93.5 24.5,93.5 82.5,44.5 24.5,44.5 4.5,4.5 4.5,39 82.5,4.5
bRestrict: area 43.5,74.2 to 46.4,74.3; area 43.5,73.7 to 46.4,73.8; area 43.5,73.2 to 46.4,73.3; area 43.5,72.7 to 46.4,72.8; area 43.5,72.2 to 46.4,72.3; area 43.5,71.7 to 46.4,71.8; area 43.5,71.2 to 46.4,71.3; area 43.5,70.7 to 46.4,70.8; area 43.5,70.2 to 46.4,70.3; area 43.5,69.7 to 46.4,69.8; area 43.5,69.2 to 46.4,69.3; area 43.5,68.7 to 46.4,68.8; area 43.5,68.2 to 46.4,68.3; area 43.5,67.7 to 46.4,67.8; area 43.5,67.2 to 46.4,67.3; area 43.5,66.7 to 46.4,66.8; area 43.5,74.7 to 46.4,74.8; area 43.5,75.2 to 46.4,75.3; area 36,64.4 to 36.2,65.5; area 29.9,75.3 to 30,75.9; area 29.5,75.3 to 29.6,75.9; area 17.5,47.6 to 27,58.5; area 64.5,52 to 66.8,52.6; area 64.5,50.8 to 66.8,51.3; area 64.5,49.5 to 66.8,50; area 35.4,64.4 to 35.6,65.5; area 38.6,91.5 to 39.4,91.7; area 38.6,91 to 39.4,91.2; area 62.8,55.2 to 71,60.3; area 46.4,87.4 to 51.3,95.7

### Footprints (pad centres in the part's own frame; a part is rotated, then mirrored left to right if it is on the bottom)
4MM = smd 1.7 x 1.7: IN 0,0 | smd 1 x 0.5: OUT 0,1.9
LSP10 = drill 1.016 pad 2.159 octagon: MP 0,0
B2,54 = smd 2.54 x 2.54: TP 0,0
6410-02 = drill 1.016 long: 1 1.27,0; 2 -1.27,0
C0603 = smd 0.8 x 0.8: 1 -0.75,0; 2 0.75,0
C1206 = smd 1.6 x 1.8: 1 -1.4,0; 2 1.4,0
SOD123 = smd 1.4 x 1.4: A 1.9,0; C -1.9,0
SFH482 = drill 0.813 long: A -1.27,0; K 1.27,0
SOT223 = smd 1.499 x 2.007: 1 -2.261,-3.15; 2 0.025,-3.15; 3 2.311,-3.15 | smd 3.81 x 2.007: 4 0,3.15
SO-08M = smd 0.6 x 2.2: 1 -1.905,-3.33; 2 -0.635,-3.33; 3 0.635,-3.33; 4 1.905,-3.33; 5 1.905,3.33; 6 0.635,3.33; 7 -0.635,3.33; 8 -1.905,3.33
R0805 = smd 1.3 x 1.5: 1 -0.95,0; 2 0.95,0
R2010 = smd 1.8 x 2.7: 1 -2.2,0; 2 2.2,0
L2012C = smd 1 x 1: 1 -1,0; 2 1,0
LED3MM = drill 0.813 octagon: A -1.27,0; K 1.27,0
MICRO3 = smd 0.8 x 0.9: 1 -0.95,-1; 2 0.95,-1; 3 0,1
MM20SS = smd 1.27 x 1.88: 1 -2.794,-1.524; 2 2.794,-1.524; 3 2.794,1.524; 4 -2.794,1.524
R0603 = smd 1 x 1.1: 1 -0.85,0; 2 0.85,0
SJ = smd 1.168 x 1.6: 1 -0.762,0; 2 0.762,0
SOT23 = smd 1 x 1.4: 1 -0.95,-1.1; 2 0.95,-1.1; 3 0,1.1
DFN22 = smd 0.25 x 0.7: 1 -2.5,-1.45; 2 -2,-1.45; 3 -1.5,-1.45; 4 -1,-1.45; 5 -0.5,-1.45; 6 0,-1.45; 7 0.5,-1.45; 8 1,-1.45; 9 1.5,-1.45; 10 2,-1.45; 11 2.5,-1.45; 12 2.5,1.45; 13 2,1.45; 14 1.5,1.45; 15 1,1.45; 16 0.5,1.45; 17 0,1.45; 18 -0.5,1.45; 19 -1,1.45; 20 -1.5,1.45; 21 -2,1.45; 22 -2.5,1.45 | smd 2.2 x 1.65: GND 1.525,0; GND1 -1.5,0 | smd 0.9 x 0.9: P$1 0,0
SOT23-5L = smd 0.55 x 1.2: 1 -0.95,-1.3; 2 0,-1.3; 3 0.95,-1.3; 4 0.95,1.3; 5 -0.95,1.3
CR1216 = smd 2.5 x 5.1: + -7.65,0; P$2 7.65,0 | smd 10.2 x 10.2: GND 0,0
SO08 = smd 0.6 x 2.2: 1 -1.905,-2.6; 2 -0.635,-2.6; 3 0.635,-2.6; 4 1.905,-2.6; 5 1.905,2.6; 6 0.635,2.6; 7 -0.635,2.6; 8 -1.905,2.6
TSSOP16 = smd 0.305 x 0.991: 1 -2.275,-2.918; 2 -1.625,-2.918; 3 -0.975,-2.918; 4 -0.325,-2.918; 5 0.325,-2.918; 6 0.975,-2.918; 7 1.625,-2.918; 8 2.275,-2.918; 9 2.275,2.918; 10 1.625,2.918; 11 0.975,2.918; 12 0.325,2.918; 13 -0.325,2.918; 14 -0.975,2.918; 15 -1.625,2.918; 16 -2.275,2.918
QFN40 = smd 0.85 x 0.28: 1 -3,2.25; 2 -3,1.75; 3 -3,1.25; 4 -3,0.75; 5 -3,0.25; 6 -3,-0.25; 7 -3,-0.75; 8 -3,-1.25; 9 -3,-1.75; 10 -3,-2.25; 21 3,-2.25; 22 3,-1.75; 23 3,-1.25; 24 3,-0.75; 25 3,-0.25; 26 3,0.25; 27 3,0.75; 28 3,1.25; 29 3,1.75; 30 3,2.25 | smd 0.28 x 0.85: 11 -2.25,-3; 12 -1.75,-3; 13 -1.25,-3; 14 -0.75,-3; 15 -0.25,-3; 16 0.25,-3; 17 0.75,-3; 18 1.25,-3; 19 1.75,-3; 20 2.25,-3; 31 2.25,3; 32 1.75,3; 33 1.25,3; 34 0.75,3; 35 0.25,3; 36 -0.25,3; 37 -0.75,3; 38 -1.25,3; 39 -1.75,3; 40 -2.25,3 | smd 2.7 x 3.5: P$2 0,0 | smd 1 x 1.5: P$11 -0.65,0.9; P$12 0.65,0.9; P$13 0.65,-0.9; THERMAL -0.65,-0.9 | drill 0.4 pad 0.406: VIA1 0,1; VIA2 -1,0; VIA3 0,0; VIA4 1,0; VIA5 0,-1
12X6.5 = drill 1 octagon: + -3.25,0; - 3.25,0
MICRO_USB = smd 0.4 x 1.4: 1_+5V -1.3,2.65; 2_D- -0.65,2.65; 3_D+ 0,2.65; 4_ID 0.65,2.65; 5_0V 1.3,2.65 | smd 4 x 1.9: GND1 0,0 | smd 1.35 x 1.9: GND2 -3.55,0; GND5 3.55,0 | smd 1.15 x 1.45: P$1 -2.4,2.25; P$7 2.4,2.25
20X2 = drill 1: P$1 0,0; P$2 0,2.54; P$3 2.54,0; P$4 2.54,2.54; P$5 5.08,0; P$6 5.08,2.54; P$7 7.62,0; P$8 7.62,2.54; P$9 10.16,0; P$10 10.16,2.54; P$11 12.7,0; P$12 12.7,2.54; P$13 15.24,0; P$14 15.24,2.54; P$15 17.78,0; P$16 17.78,2.54; P$17 20.32,0; P$18 20.32,2.54; P$19 22.86,0; P$20 22.86,2.54; P$21 25.4,0; P$22 25.4,2.54; P$23 27.94,0; P$24 27.94,2.54; P$25 30.48,0; P$26 30.48,2.54; P$27 33.02,0; P$28 33.02,2.54; P$29 35.56,0; P$30 35.56,2.54; P$31 38.1,0; P$32 38.1,2.54; P$33 40.64,0; P$34 40.64,2.54; P$35 43.18,0; P$36 43.18,2.54; P$37 45.72,0; P$38 45.72,2.54; P$39 48.26,0; P$40 48.26,2.54
QFN20-3X3 = smd 0.34 x 0.34: 1 -1.27,1.27; 6 -1.27,-1.27; 11 1.27,-1.27; 16 1.27,1.27 | smd 0.61 x 0.28: 2 -1.35,0.75; 3 -1.35,0.25; 4 -1.35,-0.25; 5 -1.35,-0.75; 12 1.35,-0.75; 13 1.35,-0.25; 14 1.35,0.25; 15 1.35,0.75 | smd 0.28 x 0.61: 7 -0.75,-1.35; 8 -0.25,-1.35; 9 0.25,-1.35; 10 0.75,-1.35; 17 0.75,1.35; 18 0.25,1.35; 19 -0.25,1.35; 20 -0.75,1.35 | smd 1.7 x 1.7: P$1 0,0
DFN-10_2X2 = smd 0.6 x 0.225: 1 -0.9,0.8; 2 -0.9,0.4; 3 -0.9,0; 4 -0.9,-0.4; 5 -0.9,-0.8; 6 0.9,-0.8; 7 0.9,-0.4; 8 0.9,0; 9 0.9,0.4; 10 0.9,0.8
70543-03 = drill 1.016 long: 1 -2.54,0; 2 0,0; 3 2.54,0
FH12-50S-0.5SH = smd 1.3 x 0.3: 1 3.95,27.8; 2 3.95,27.3; 3 3.95,26.8; 4 3.95,26.3; 5 3.95,25.8; 6 3.95,25.3; 7 3.95,24.8; 8 3.95,24.3; 9 3.95,23.8; 10 3.95,23.3; 11 3.95,22.8; 12 3.95,22.3; 13 3.95,21.8; 14 3.95,21.3; 15 3.95,20.8; 16 3.95,20.3; 17 3.95,19.8; 18 3.95,19.3; 19 3.95,18.8; 20 3.95,18.3; 21 3.95,17.8; 22 3.95,17.3; 23 3.95,16.8; 24 3.95,16.3; 25 3.95,15.8; 26 3.95,15.3; 27 3.95,14.8; 28 3.95,14.3; 29 3.95,13.8; 30 3.95,13.3; 31 3.95,12.8; 32 3.95,12.3; 33 3.95,11.8; 34 3.95,11.3; 35 3.95,10.8; 36 3.95,10.3; 37 3.95,9.8; 38 3.95,9.3; 39 3.95,8.8; 40 3.95,8.3; 41 3.95,7.8; 42 3.95,7.3; 43 3.95,6.8; 44 3.95,6.3; 45 3.95,5.8; 46 3.95,5.3; 47 3.95,4.8; 48 3.95,4.3; 49 3.95,3.8; 50 3.95,3.3 | smd 2.4 x 2.4: P$1 0.7,1.2; P$2 0.7,29.9

### Placement (x,y rotation side)
1  6.43,34.63 0 top
2  13.86,34.63 0 top
3  21.27,34.63 0 top
4  28.68,34.63 0 top
5  36.2,34.63 0 top
6  43.51,34.63 0 top
7  50.97,34.63 0 top
8  58.33,34.63 0 top
9  65.73,34.63 0 top
10  73.16,34.63 0 top
11  80.56,34.63 0 top
12  80.56,26.39 0 top
!  65.73,12.71 0 top
(  73.16,19.55 0 top
)  80.56,19.55 0 top
,  73.16,12.71 0 top
.  80.56,12.71 0 top
?  58.33,12.71 0 top
@  65.73,5.87 0 top
A  6.43,19.55 0 top
ANTENNA  42.7,94.92 0 bottom
AUDIO_L  33,94 0 bottom
AUDIO_R  30.5,86 0 bottom
B  36.2,12.71 0 top
BATTERY  95.8,77.62 0 bottom  (outside the outline)
C  21.27,12.71 0 top
C1  66.08,81.1 270 bottom
C2  36.6,56.02 90 bottom
C3  35.17,56.02 90 bottom
C4  32.33,56.02 90 bottom
C5  78.1,89.72 90 bottom
C6  18.75,69.85 90 bottom
C7  33.52,51.6 270 bottom
C8  39.6,88.12 270 bottom
C9  46.48,51.38 270 bottom
C10  62.65,95.4 0 bottom
C11  70.1,95.47 90 bottom
C12  61.08,92.33 0 bottom
C13  83.05,89.72 90 bottom
C14  64.6,81.1 270 bottom
C15  55.83,86.12 180 bottom
C16  81.35,89.72 90 bottom
C17  79.72,89.72 90 bottom
C18  33.75,56.02 90 bottom
C19  25.6,61.4 270 bottom
C20  22.38,61.58 0 bottom
C21  18.57,53.48 270 bottom
C22  43.65,86.65 0 bottom
C23  48.12,51.38 270 bottom
C24  38.85,95.6 180 bottom
C25  81.35,85.22 270 bottom
C26  36.52,94.1 180 bottom
C27  36.52,92.67 180 bottom
C28  36.52,91.25 0 bottom
C29  36.52,89.83 0 bottom
C30  34.77,75.12 270 bottom
C31  28.05,76.8 270 bottom
C32  28.07,73.47 270 bottom
C33  63.08,81.1 270 bottom
C34  83.05,85.22 270 bottom
C35  18.73,66.88 90 bottom
D  21.27,19.55 0 top
D1  25.6,65.62 90 bottom
D2  54.5,90.7 270 bottom
D5  29.62,90.33 0 bottom
E  21.27,26.39 0 top
F  28.68,19.55 0 top
FN-RIGHT  76.86,5.87 0 top
G  36.2,19.55 0 top
GND  34.5,86 0 bottom
H  43.51,19.55 0 top
I  58.33,26.39 0 top
IC1  74.95,83.28 90 bottom
IC2  62.3,51.02 270 bottom
J  50.97,19.55 0 top
K  58.33,19.55 0 top
L  65.73,19.55 0 top
L1  23.62,69.95 180 bottom
L2  57.52,91 270 bottom
L3  44.88,94.45 90 bottom
LED4  17,39.5 0 top
LED5  22,39.5 0 top
LED6  27,39.6 0 top
M  50.97,12.71 0 top
N  43.51,12.71 0 top
O  65.73,26.39 0 top
P  73.16,26.39 0 top
Q  6.43,26.39 0 top
Q1  40.1,51.35 180 bottom
Q2  68.67,76.2 90 bottom
Q3  66.9,57.78 0 bottom
Q4  68.92,86.85 180 bottom
Q5  48.85,91.53 270 bottom
R  28.68,26.39 0 top
R1  78.65,50.77 180 bottom
R2  33.15,67.62 90 bottom
R3  78.67,48.67 180 bottom
R4  55.67,51.6 0 bottom
R5  55.67,49.45 0 bottom
R6  35.25,67.62 90 bottom
R7  68.4,95.47 90 bottom
R8  57.25,95.58 0 bottom
R9  72.28,89 180 bottom
R10  66.35,95.47 90 bottom
R11  37.8,40 180 bottom
R12  35,40 90 bottom
R13  39.08,79.9 0 bottom
R14  39.08,77.88 0 bottom
R15  39.08,75.88 0 bottom
R16  39.77,72.92 90 bottom
R17  41.8,72.92 90 bottom
R18  40.25,61.38 180 bottom
R19  40.25,59.42 180 bottom
R20  40.25,57.48 180 bottom
R21  40.25,55.48 180 bottom
R22  42.67,51.38 90 bottom
R23  44.7,51.38 90 bottom
R24  37.35,51.5 270 bottom
R25  35.27,51.5 270 bottom
R26  68.9,92.25 270 bottom
R27  71.78,91.4 180 bottom
R28  30.73,40 180 bottom
R31  44.4,90.8 0 bottom
R32  44.4,88.85 0 bottom
R33  30.95,77.55 0 bottom
R34  33.05,75.03 90 bottom
R35  18.82,58.17 90 bottom
R36  22.27,63.3 180 bottom
R37  19.27,62.62 90 bottom
R38  19.45,48.88 180 bottom
R39  27.45,85.7 270 bottom
R40  24.48,84.9 0 bottom
R41  24.73,49.73 270 bottom
R43  65.47,75.1 0 bottom
R44  65.47,77.15 0 bottom
S  13.86,19.55 0 top
SHIFT-RIGHT  54.62,5.87 0 top
SHILFT-LEFT  10.14,5.87 0 top
SJ1  76.22,88.42 270 bottom
SPACE1  22.5,5.87 0 top
SPACE2  32.38,5.87 0 top
SPACE3  42.27,5.87 0 top
T  36.2,26.39 0 top
T1  24.4,88.22 0 bottom
T2  60.67,86.5 270 bottom
T5  20.95,56.23 0 bottom
T6  21.68,51.58 90 bottom
T7  24.57,56.08 90 bottom
U  50.97,26.39 0 top
U$1  65.22,90.17 270 bottom
U$2  21.85,66.85 90 bottom
U$3  39.23,82.47 270 bottom
U$4  79.5,65 90 bottom
U$5  74.2,51.75 180 bottom
U$6  34.85,62 0 bottom
U$7  79.9,30.62 90 bottom
U$8  67,68 0 bottom
U$9  75.5,96.8 180 bottom
U$11  77.55,45.55 180 top
U$12  40.35,91.6 0 bottom
U$13  30.55,74.7 90 bottom
V  28.68,12.71 0 top
W  13.86,26.39 0 top
X  13.86,12.71 0 top
X3  83.1,51.5 270 bottom
X5  49,54.2 0 bottom
Y  43.51,26.39 0 top
Z  6.43,12.71 0 top

### Tracks (layer width: path | path; a pad name or v marks a point on that pad's centre or on a via)
+3V3  (via drill 0.5)
  Top 0.406: v37.52,87.62 v45.33,87.62
  Bottom 0.2: R33.2 30.55,76.95 U$13.8 30.55,75.15 31,74.7 31.35,74.7 | U$13.1 31.35,74.7 | 31.35,74.7 31.75,74.7 32.92,75.88 R34.2
  Bottom 0.254: C28.1 C29.1 37.17,89.58 | U$12.10 39.6,89.72 39.08,89.72 U$12.11 | 37.27,58.6 37.12,58.75 U$6.1 | X5.3 45.02,81 | 48.02,79 47.45,78.5 45.08,78.5 | 48.02,79 48.08,79.5 X5.6 43,79.5 42.9,79.5 42.9,79.2 42.9,79.15 43.05,79 | 48.73,80.5 48.73,80 X5.5 42.9,80 | 48.73,80.5 49.6,81 | 49.6,81 49.6,81.5 X5.2 42.9,81.5 | 48.73,80.5 X5.4 42.9,80.5 | 48.02,79 X5.7 43.05,79 | X5.3 42.9,81 | 49.6,81 X5.3 | 43.05,79 43.55,78.5 X5.8
  Bottom 0.305: X5.35 43.92,65 | 45.23,80.5 X5.4 | 45.3,78.5 45.08,78.5 X5.8 | 42.75,81.5 42.9,79.2 | 42.9,81.5 43,81.5 43,79.5 43,79.12
  Bottom 0.406: 39.08,89.72 37.27,89.72 C29.1 | 45.42,90.97 R31.1 R32.1 45.33,88.78 v45.33,87.62 | 37.4,89.83 C29.1 | v37.52,87.62 37.52,87.72 37.08,88.17 37.08,89.62 C29.1 | C30.1 R34.2 | C31.1 R33.2
  Bottom 0.61: C3.1 C2.1 | C2.1 37.4,55.27 37.88,55.75 37.88,58 37.27,58.6 | 43.92,65 43.08,65 39.55,68.5 35.75,68.48 | R15.2 R14.2 R13.2 38.23,82.38 U$3.3 37.52,82.47 v37.52,87.62 | 35.75,68.48 R6.2 R2.2 31.62,68.47 29.3,66.15 29.3,53.45 30.4,52.35 32.1,52.35 | 42.9,81.5 42.9,83.17 44.4,84.67 C22.1 45.33,87.58 v45.33,87.62 | 32.1,52.35 C7.1 R25.1 35.27,52.55 36.6,53.88 C2.1 | R15.2 C30.1 | C33.1 63.08,83.28 | 63.08,83.28 62.98,83.28 | C14.1 64.6,83.28 | 64.6,83.28 64.38,83.28 63.08,83.28 | C1.1 66.08,83.28 | 66.08,83.28 65.6,83.28 64.6,83.28 | R44.1 Q2.2 67.65,83.28 66.08,83.28 | 32.1,52.35 32.1,49.88 33.1,48.88 33.1,38.92 32.5,38.33 27,38.33 LED6.A 24.45,40.88 20.73,40.88 | LED4.A 17.45,41.23 19.07,41.23 19.43,40.88 20.73,40.88 | 20.73,40.88 LED5.A | 35.75,68.48 38.25,68.48 | 38.62,68.48 38.25,68.48 | 38.25,68.48 38.25,75.88 R15.2
  Bottom 1.016: 48.08,79.5 52.45,83.88 62.08,83.88 62.7,83.28 62.98,83.28 64.38,83.28 65.6,83.28 71.3,83.28 IC1.2
+5V  (via drill 0.5, 0.6)
  Top 0.254: 77.55,43.05 76.28,43.05 76.28,46.52
  Top 0.61: 50.42,54.35 50.33,54.35
  Top 1.27: 76.28,46.52 76.28,49.3 72.95,52.62 62.02,52.62 60.27,54.35 50.42,54.35 47.25,54.35 v46.08,55.52 42.45,59.15 v42.45,61.42 42.45,67.3 39.3,70.45 v34.85,70.45
  Bottom 0.254: U$1.13 62.95,88.17 62.95,87.9 | U$2.3 20.55,68.17
  Bottom 0.305: X5.43 42.83,61 v42.45,61.42
  Bottom 0.406: C23.1 C9.1 46.48,53.35 46.08,53.75 v46.08,55.52 | R27.2 73.08,91.4 74.6,89.92 74.6,87.53
  Bottom 0.61: 69.9,87.53 Q4.2 69.9,87.85 | X3.3 83.41,48.95 86,48.95 | C16.1 81.35,87.47 C25.1 | C34.1 83.05,87.2 | 83.05,87.2 83.1,87.47 | C13.1 83.05,87.2 | C6.1 20.38,69.1 20.55,69.28 | R39.2 27.35,84.75 27.35,83.05 25.32,81.03 25.32,72.25
  Bottom 0.813: T2.2 62.6,85.55 63.73,84.42 69.75,84.42 71.14,85.81 IC1.3 | L1.1 22.65,69.92
  Bottom 1.016: 76.22,87.53 74.6,87.53 71.3,87.53 | 71.3,87.53 69.9,87.53 | 77.3,87.47 77.74,87.54 SJ1.2 76.22,87.53 | 76.24,87.52 76.26,87.5 76.28,87.5 76.25,87.53 76.22,87.53 | IC1.3 71.3,85.81 71.3,87.53 | 20.55,68.17 20.55,69.28 21.23,69.95 L1.1 22.68,71.6 23.32,72.25 25.32,72.25 25.77,72.25 28,70.03 30.65,70.03 31.07,70.45 35.92,70.45
  Bottom 1.422: v34.85,70.45 35.92,70.45 v36.42,70.45 | U$11.P$4 79.49,43.01 81.1,41.4 84.05,41.4 86,43.35 86,48.95 86,86.33 84.85,87.47 83.1,87.47 81.35,87.47 77.3,87.47
  pour Bottom (isolate 0.254, no thermals): 64.05,88.42 61.4,88.42 61.38,87.45 61.4,85.15 62.75,85.15 63.25,85.62 63.25,86.55
  pour Bottom (no thermals): 66.65,88.17 70.33,88.17 70.72,87.9 71.95,87.9 72.33,87.7 72.33,87.12 67.55,87.12 66.83,87.03 66.65,87.2
  pour Top: 73.78,44.15 73.78,42.2 74.22,41.75 78.33,41.75 78.8,42.25 78.78,44.25 76.7,46.23 75.85,46.23
  pour Bottom (isolate 0.254): 45.38,60.5 45.38,61.5 43.8,61.5 43.02,62.27 41.4,62.27 41.4,61.12 42,60.52 42.02,60.5
+15V
  Bottom 0.61: R35.2 18.57,59.45 19.35,60.23 22.7,60.23 23.12,60.65 C20.1 R36.2 23.55,63.73 D1.C C19.1
ACC_INT1  (via drill 0.5)
  Top 0.305: 43.4,50.42 58.58,50.42 61.05,47.95 61.05,44.65 61.4,44.3 63.56,44.3 U$11.P$12
  Top 0.406: 43.4,50.42 30.43,63.4 v30.43,72.28
  Bottom 0.254: U$13.3 30.55,72.4 v30.43,72.28
ACC_INT2  (via drill 0.5)
  Top 0.305: U$11.P$16 58.5,44.28 58.5,47.95 56.9,49.55 42.67,49.55
  Top 0.406: 42.67,49.55 29.25,62.98 v29.25,71.53
  Bottom 0.2: v29.25,71.53 29.25,72.25 29.75,72.75 U$13.5
AUDIO_L
  Bottom 0.406: C26.1 33.1,94.1 AUDIO_L.TP
AUDIO_R
  Bottom 0.406: C27.1 34.85,92.67 32.77,90.6 32.77,88.67 30.5,86.4 AUDIO_R.TP
BASE
  Bottom 0.61: T1.1 25.35,85.12 R40.1
BAT  (1 unrouted)
  Bottom 0.254: 66.67,87.35 U$1.11
  Bottom 0.813: 66.67,87.35 66.67,86.92 67.12,86.47 68.3,86.47 Q4.3
BEEPER  (via drill 0.5)
  Top 0.305: U$11.P$13 62.31,46.44 63.2,47.33 68.38,47.33 v69.88,48.83
  Bottom 0.254: v69.88,48.83 69.88,50.92 70.58,51.62 73.15,51.62 74.2,52.67 74.2,60.35 64.6,69.95 R43.2 64.62,76.12 | 64.62,76.12 R44.2 | 64.6,76.15 64.62,76.12
BOOST
  Bottom 0.254: U$1.19 62.67,91.17 61.67,92.17 C12.1
CE0
  Bottom 0.305: X5.38 47.65,63.5 50.5,60.65 50.5,49.58 48.35,47.42 48.35,44.27 U$11.P$24
COL0  (via drill 0.5, 0.6)
  Top 0.254: 13.85,34.65 13.84,34.65 2.IN | 4.IN 28.42,34.63 v28.68,34.65 | 5.IN 35.97,34.63 v36.2,34.65 | 6.IN 43.27,34.63 v43.5,34.62 | 7.IN 50.67,34.63 v50.98,34.62 | 8.IN 58.18,34.63 v58.33,34.62 | 9.IN 65.52,34.63 v65.53,34.65
  Top 0.406: 11.IN
  Top 0.61: 10.IN arc-90 10.IN v73.03,34.62 | 11.IN v80.72,34.98 | 3.IN v21.27,34.56 v21.27,34.55 | 1.IN v6.52,34.63 v6.53,34.62 | v13.88,34.62 13.9,34.62 2.IN
  Bottom 0.254: 28.7,34.65 29.2,34.65 v36.2,34.65 36.75,34.65 37.48,35.38 41.52,35.38 42.27,34.62 v43.5,34.62 43.27,34.63 6.IN 43.52,34.65 44.45,34.65 45.42,35.62 48.55,35.62 49.52,34.65 v50.98,34.62 50.7,34.6 v58.33,34.62 58.18,34.63 8.IN 58.34,34.65 65.03,34.65 | 28.7,34.65 4.IN 28.42,34.63 v28.68,34.65 28.7,34.65 | 65.69,34.63 65.52,34.63 v65.53,34.65 65.55,34.63 9.IN | U$7.29 81.65,34.38 81.03,34.98 v80.72,34.98 80.72,39.45 78.83,41.4 73.95,41.4 73.03,40.48 v73.03,34.62
  Bottom 0.406: 15.63,34.62 15.71,34.55 v21.27,34.55
  Bottom 0.61: 28.65,34.65 v28.68,34.65 | v28.68,34.65 29.2,34.65 36.75,34.65 37.62,35.52 41.33,35.52 42.2,34.65 44.48,34.65 45.48,35.65 48.5,35.65 49.52,34.62 65.03,34.65 v65.53,34.65 73,34.65 | v73.03,34.62 arc90 73,34.65 | 10.IN arc90 73.14,34.65 73,34.65 | v28.68,34.65 27.15,34.62 15.63,34.62 14.44,34.62 v13.88,34.62 v6.53,34.62
COL1  (via drill 0.5, 0.6)
  Top 0.254: v13.82,26.38 W.IN | E.IN 21.3,25.99 21.3,26.05 | 28.55,26.39 R.IN 28.7,26.02 v28.7,26.4 | 28.55,26.39 v28.7,26.4 | T.IN 36.05,26.39 v36.2,26.38 | 21.1,26 v21.27,26.35 | v21.27,26.35 21.3,26.05 | 21.3,26.05 21.35,26 v21.27,26.35 | 28.55,26.39 28.6,26.34 28.6,26 v28.7,26.4 | 12.IN 80.44,26.39 v80.58,26.02 | v85.4,34.02 85.42,27.15 v83.85,25.57
  Top 0.406: Y.IN v43.45,26.38 | U.IN 51,26.36 v50.98,26.4 | I.IN v58.33,26.38 | O.IN v65.75,26.38 65.78,26.35 | P.IN v73.17,26.4
  Top 1.016: Q.IN 6.54,26.39 v6.45,26.38
  Bottom 0.254: v13.82,26.38 W.IN | T.IN 36.05,26.39 v36.2,26.38 | U$7.30 82.15,34.02 v85.4,34.02
  Bottom 0.406: v73.17,26.4 P.IN | P.IN 73.12,26.38 72.12,26.38 71.42,25.68 67.83,25.68 67.12,26.38 v65.75,26.38 v58.33,26.38 58.12,26.38 v50.98,26.4 50.9,26.4 v43.45,26.38 v36.2,26.38 28.73,26.38 v28.7,26.4 28.56,26.4 28.51,26.35 v21.27,26.35 13.85,26.35 v13.82,26.38 v6.45,26.38 | P.IN v73.17,26.4 73.5,26.4 74.33,25.57 80.58,25.55 | 80.58,25.55 v80.58,26.02 | v83.85,25.57 83.3,25.57 80.58,25.55
COL2  (via drill 0.5, 0.6)
  Top 0.254: SHILFT-LEFT.IN 10.28,5.87 arc-90 v10.15,5.85 | v22.5,5.85 22.52,5.85 SPACE1.IN | SPACE2.IN 32.27,5.87 v32.45,5.85 | SPACE3.IN 42.23,5.87 v42.2,5.9 | SHIFT-RIGHT.IN 54.57,5.87 v54.55,5.85 | @.IN 65.67,5.87 v65.65,5.85 | FN-RIGHT.IN 76.72,5.87 v76.7,5.85
  Bottom 0.254: v22.5,5.85 v32.45,5.85 32.43,5.87 SPACE2.IN 32.41,5.9 v42.2,5.9 42.25,5.85 v54.55,5.85 v65.65,5.85 v76.7,5.85 76.72,5.87 FN-RIGHT.IN 76.86,9.3 78.78,11.22 82.21,11.22 85.97,14.99 85.97,31.93 85.03,32.88 U$7.31 82.58,32.88 | 17.52,5.85 17.52,5.9 17.57,5.85
  Bottom 0.61: v10.15,5.85 17.57,5.85 v76.7,5.85
COL3  (via drill 0.5, 0.6)
  Top 0.254: Z.IN 6.25,12.7 v6.45,12.7 | v13.85,12.7 14.49,12.71 X.IN | C.IN 21.25,12.7 v21.2,12.7 | V.IN 28.66,12.7 v28.6,12.7 | B.IN 36.19,12.7 v36.05,12.7 | N.IN 43.49,12.7 v43.3,12.7 | M.IN 50.95,12.7 v50.7,12.7 | ?.IN v58.2,12.71 v58.2,12.7 | !.IN v65.55,12.71 v65.55,12.7 | ,.IN v73,12.71 v73,12.7 | ..IN v80.4,12.71 v80.4,12.7
  Bottom 0.254: v50.7,12.7 v50.69,12.71 50.15,12.71 | 50.15,12.71 N.IN 43.49,12.7 v43.3,12.7 v36.05,12.7 v36.04,12.71 V.IN 28.66,12.7 v28.6,12.7 v28.59,12.71 C.IN 21.25,12.7 v21.2,12.7 v13.85,12.7 | v58.2,12.7 50.15,12.7 50.15,12.71 | v65.55,12.7 v73,12.7 v80.4,12.7 | ..IN v80.41,12.71 v80.4,12.7 | 10.12,12.7 10.53,12.7 | v80.4,12.7 85.5,17.8 85.5,31.73 84.85,32.38 U$7.32
  Bottom 0.61: v65.55,12.7 v58.2,12.7 | v6.45,12.7 10.53,12.7 v80.4,12.7
COL4  (via drill 0.6)
  Top 0.254: ).IN v80.4,19.55 | v73.05,19.55 (.IN | L.IN v65.85,19.55 | K.IN v58.2,19.55 | J.IN v51.1,19.55 | H.IN v43.65,19.55 | G.IN v36.35,19.55 | F.IN v28.8,19.55 | D.IN v21.45,19.55 | S.IN v14.05,19.55 | A.IN v6.35,19.55
  Bottom 0.254: v14.05,19.55 v21.45,19.55 v28.8,19.55 v36.35,19.55 v43.65,19.55 v51.1,19.55 v58.2,19.55 v65.85,19.55 v73.05,19.55 v80.4,19.55 ).IN | 80.65,19.55 ).IN | ).IN 85.03,24.01 85.03,31.48 84.62,31.88 U$7.33
  Bottom 0.61: v6.35,19.55 v80.4,19.55
COLLECTOR
  Bottom 0.61: T1.3 27.23,89.33 28.23,90.33 D5.K
D/C  (via drill 0.5)
  Top 0.305: U$11.P$22 50.88,44.28 50.88,46.5 v50,47.38
  Bottom 0.305: X5.37 47.95,64 51.08,60.88 51.08,48.45 v50,47.38
DE
  Bottom 0.254: X5.13 42.92,76 41.8,74.88 R17.2
DISPLAY_RESET
  Bottom 0.305: X5.9 41.83,78 R13.1
  Bottom 0.61: R13.1 39.92,81.12 U$3.2
FB
  Bottom 0.406: U$2.2 21.48,66.85 21.73,66.6 21.7,63.3 R36.1
  Bottom 0.61: C20.2 21.62,63.1 R36.1 19.82,63.3 R37.2
FM_RESET  (via drill 0.5)
  Top 0.406: U$11.P$29 41.99,48.38 27.82,62.55 27.82,80.33 39.62,92.12 v43.73,92.12
  Bottom 0.254: R31.2 43.92,90.85 U$12.5
  Bottom 0.406: v43.73,92.12 43.73,91.22 R31.2
GND  (via drill 0.5, 0.6)  (2 unrouted)
  Bottom 0.2: 30.15,76.28 U$13.7 30.15,75 29.75,75 U$13.6 29.75,76.3
  Bottom 0.254: 45,66.5 46.73,66.5 46.9,66.67 46.9,67 | X5.50 45.05,54.5 | X5.1 45.05,83.97 | U$1.16 64.95,89.67 | 64.95,89.67 65.22,89.67 v65.22,89.12 U$1.GND | U$1.1 64.95,92.67 64.95,89.67 | U$12.3 40.35,91.85 U$12.P$1 40.35,91.35 U$12.13 38.23,91.35 | U$12.12 38.5,90.85 arc90 38,90.35 | 38.17,91.85 U$12.14 39.62,91.85 | U$7.4 80.65,30.2 U$7.VIA3
  Bottom 0.305: 43.3,75 43.3,75.5 X5.14 46.95,75.5 46.9,75 | 43.3,75 43.3,74.5 | 43.3,74.5 43.3,74 | 43.3,74 43.3,73.5 | 43.3,73.5 43.3,73 | 43.3,73 43.3,72.5 | 43.3,72.5 43.3,72 | 43.3,72 42.8,71.5 | 42.8,71.5 42.8,71 | 42.8,71 42.8,70.5 | 42.8,69.5 42.8,69 | 42.8,69 42.8,68.5 | 42.8,68.5 42.8,68 | 42.8,68 42.8,67.5 | 42.8,67.5 42.8,67 | 42.8,67 43.3,66.5 45,66.5 X5.32 | 42.8,67 X5.31 46.9,67 46.9,67.5 | 42.8,67.5 X5.30 46.9,67.5 | 42.8,68 X5.29 46.9,68 | 42.8,68.5 X5.28 46.9,68.5 | 42.8,69 X5.27 46.9,69 | 42.8,69.5 X5.26 46.9,69.5 | 42.8,70.5 X5.24 46.9,70.5 | 42.8,70.5 42.8,70 | 42.8,70 X5.25 46.9,70 | 42.8,70 42.8,69.5 | 42.8,71 X5.23 46.9,71 | 42.8,71.5 X5.22 46.9,71.5 | 43.3,72 X5.21 46.9,72 | 43.3,72.5 X5.20 46.9,72.5 | 43.3,73 X5.19 46.9,73 | 43.3,73.5 X5.18 46.9,73.5 | 43.3,74 X5.17 46.9,74 | 43.3,75 X5.15 46.9,75 | 43.3,74.5 X5.16 46.9,74.5 | 46.9,75 46.9,74.5 | 46.9,74.5 46.9,74 | 46.9,74 46.9,73.5 | 46.9,73.5 46.9,73 | 46.9,73 46.9,72.5 | 46.9,72.5 46.9,72 | 46.9,72 46.9,71.5 | 46.9,71.5 46.9,71 | 46.9,71 46.9,70.5 | 46.9,70.5 46.9,70 | 46.9,70 46.9,69.5 | 46.9,69.5 46.9,69 | 46.9,69 46.9,68.5 | 46.9,68.5 46.9,68 | 46.9,68 46.9,67.5
  Bottom 0.406: U$7.VIA5 79.45,30.3 U$7.THERMAL | 20.55,52.55 T6.2
  Bottom 0.61: 27.3,53.4 21.8,53.4 20.95,52.55 20.55,52.55 20.32,52.55 | T5.2 20.57,54.55 T6.2
  Bottom 1.016: v65.22,92.33 65.22,93.35
  other vias: 65.22,91.22 65.22,88.05 77.92,39.85 59.7,47.67 40.83,94.35 50.3,64.28 52.42,96.72 52.42,94.7 52.42,92.67 52.42,90.65 52.42,88.62 52.42,86.6 18.65,47.1 20.15,47.1 21.65,47.1 23.12,47.1 27.5,50.55 27.5,52 27.5,53.48 27.5,54.98 27.5,56.5 27.5,57.98 26.48,59 25,59 23.5,59 22.02,59 20.52,59 34.33,96.35 36.35,96.35 29.1,83.67 18.77,74.72 47.6,75.17 36.95,76.97 35.83,81.75 50.5,86.6 47.6,77.2 85.28,35.95 63.1,96.88 61.08,96.88 48.58,86.6 46.65,86.6 33.98,90.05 22.65,89.8 64.62,61.05 66.67,61.05 68.72,61.05 70.78,61.05 59.05,96.88 47.6,73.15 47.6,71.12 47.6,69.1 47.6,67.08 33.98,88.25 64.65,54.38 66.7,54.38 68.75,54.38 62.58,61.05 62.6,54.38 48.52,96.72 50.48,96.72 47.6,61.17 47.6,59.12 38.4,67.5 39.42,66.47 40.45,65.45 26.75,76.85 26.75,75.28 36.95,74.78 70.8,54.38 62.08,47.67 27.5,48.48 24.6,47.1 26.1,47.1 51.35,63.23 45.88,40.23 48.55,40.23 26.75,73.7
  pour Bottom (rank 6): 17.5,42.5 1.5,42.5 arc90 0,41 0,5 arc90 5,0 82,0 arc90 87,5 87,94 arc90 83,98 23,98 arc90 21.5,96.5 21.5,77.02 arc-90 20.48,76 18.5,76 arc90 17.5,75
  pour Top (rank 6): 17.5,42.5 1.5,42.5 arc90 0,41 0,5 arc90 5,0 82,0 arc90 87,5 87,94 arc90 83,98 23,98 arc90 21.5,96.5 21.5,77 arc-90 20.5,76 18.5,76 arc90 17.5,75
H_SYNC
  Bottom 0.305: X5.11 41.05,77 R15.1
HVOUT
  Bottom 0.254: U$1.18 62.42,90.67 61.92,91.17 61.88,91.17
  pour Bottom (rank 2): 64.12,90.9 63.2,90.92 62.2,91.92 59.73,91.92 58.05,91.42 56.7,91.42 55.67,91.4 55.67,84.72 61.1,84.72 61.12,87.88 61.08,89.85 64.17,90.1 64.17,90.62
HVPR  (via drill 0.5)
  Top 0.406: v60.1,88.22 60.1,86.88 61.88,85.12 62.35,84.65 66,84.65 v71.67,90.33
  Bottom 0.254: U$1.7 69.8,89.67 70.45,90.33 71.18,90.31 | 71.18,90.31 v71.67,90.33 | R27.1 70.92,90.31 71.18,90.31
  Bottom 0.406: v60.1,88.22 60.73,88.22 61.5,87.45 T2.1
ID_SC
  Bottom 0.406: R4.1 57.73,50.39 IC2.6 59.55,50.4 60.4,50.4 61.02,49.77 61.02,41.08 58.75,38.8 45.75,38.8 44.53,40.02 U$11.P$28
ID_SD
  Bottom 0.406: 58.95,49.1 IC2.5 | 59.2,49.12 IC2.5 | 56.58,49.12 R5.1 56.93,49.12 58.5,49.12 | U$11.P$27 45.8,44.28 45.8,41.85 46.27,41.38 58,41.38 58.5,41.88 58.5,49.12 | 58.5,49.12 IC2.5
IN  (via drill 0.5, 0.7)
  Top 1.016: v62.3,89.33 62.3,87.35 63.48,86.17 v65.17,86.17 71.22,92.22 v75.55,92.22 76,92.28
  Top 1.27: v75.55,92.22 v78.88,92.22
  Bottom 0.254: 63.77,87.55 U$1.12 | U$1.15 62.9,89.17 v62.3,89.33
  Bottom 0.406: 63.77,87.55 63.77,86.65 v64.08,86.17 | U$9.1_+5V 74.2,92.75
  Bottom 0.61: C17.1 C5.1 76.31,88.97 SJ1.1
  Bottom 1.016: 76,92.28 v75.55,92.22
  Bottom 1.27: v77.2,92.22 v75.55,92.22 74.7,92.25 74.2,92.75 | v77.2,92.22 v78.88,92.22 | SJ1.1 76.22,92.22 v77.2,92.22
  pour Bottom (no thermals): 63.7,87.1 63.68,86.24 arc91 64.21,85.7 65.05,85.7 arc90 65.53,86.18 arc77 65.19,86.6 64.4,86.6 64,87.05 63.83,87.28
  pour Bottom: 61.55,88.9 61.73,88.65 63.95,88.65 63.95,90.17 61.88,90.17 61.55,89.83
INT_KB  (via drill 0.5)
  Top 0.305: v47.6,29.15 47.2,29.55 47.2,42.88 U$11.P$26
  Bottom 0.254: U$7.12 47.85,28.9 v47.6,29.15
INT_RTC
  Bottom 0.406: U$11.P$7 70.28,45.55 71.72,47 72.78,47 73.56,47.79 U$5.7 73.55,48.71
INT_TOUCH  (via drill 0.5)
  Top 0.406: U$11.P$31 31.4,53.6 v31.4,53.83
  Bottom 0.305: U$6.10 33.23,64.38 30.52,61.67 30.52,54.38 31.12,53.83 v31.4,53.83
IR_RX
  Bottom 0.305: U$11.P$11 66.22,44.17 77.9,44.17 80.75,47.02 80.75,52.4 82.39,54.04 X3.1
IR_TX  (via drill 0.5)
  Top 0.406: U$11.P$35 34.37,46.51 28.68,52.2 28.68,58.92 23.6,64 v23.6,83.72
  Bottom 0.406: R40.2 23.6,84.88 v23.6,83.72
LED0
  Bottom 0.61: U$11.P$38 31.83,40.33 R28.2
LED1
  Bottom 0.61: U$11.P$36 34.37,41.48 R12.2
LED2
  Bottom 0.61: U$11.P$32 39.45,40.8 R11.2
LEDK1
  Bottom 0.254: X5.44 41.98,60.5 R18.2
LEDK2
  Bottom 0.254: X5.45 41.73,60 R19.2
LEDK3
  Bottom 0.254: X5.46 43.45,59.5 41.35,57.45 R20.2
LEDK4
  Bottom 0.254: X5.47 43.65,59 42.2,57.55 42.2,56.52 R21.2
LEDK5
  Bottom 0.254: X5.48 43.83,58.5 42.67,57.35 R22.2
LEDK6
  Bottom 0.254: X5.49 43.98,58 43.15,57.17 43.15,53.77 R23.2
LX
  Bottom 0.61: U$2.5 24.57,65.9 25.6,66.92 D1.A
  Bottom 0.813: L1.2 25.6,68.92 D1.A
MISO  (via drill 0.5)
  Top 0.305: v54.52,47.48 52.62,47.48 52.15,47 U$11.P$21
  Bottom 0.305: X5.33 51.05,66 53.42,63.62 53.42,48.45 v54.52,47.48
MOSI
  Bottom 0.305: X5.34 50.83,65.5 52.92,63.4 52.92,47.31 U$11.P$19
N$1
  Bottom 0.406: 69.69,59.08 Q3.4 70.9,58.1 70.9,56.45 71.28,56.08 73.17,56.08 73.56,55.69 U$5.2
N$2
  Bottom 0.406: U$5.1 72.3,54.98 71.88,55.4 70.55,55.4 Q3.1
N$3
  Bottom 0.254: U$1.9 70.92,88.67 R9.1
N$4
  Bottom 0.254: U$1.3 67.33,91.67 67.47,91.83 67.47,93.5 R10.1
N$5  (via drill 0.5)
  Top 0.406: v60.27,89.67 59.17,90.7 v59.17,95.4
  Bottom 0.254: U$1.14 62.73,88.67 62.45,88.4 61.55,88.4 v60.27,89.67
  Bottom 0.406: v59.17,95.4 58.1,95.4 R8.1
N$6
  Bottom 0.254: U$1.4 67.75,91.17 67.97,91.4 67.97,94.08 68.62,94.75 R7.1
N$7  (via drill 0.5)
  Top 0.406: v61.42,90.55 61.42,94.78 v60.8,95.4
  Bottom 0.254: U$1.17 61.8,90.17 v61.42,90.55
  Bottom 0.406: v60.8,95.4 C10.2
N$8
  Bottom 0.406: R7.2 70.2,96.33 C11.2
N$9
  Bottom 0.254: U$1.22 63.35,92.67 63.35,92.17 U$1.21
N$11
  Bottom 0.61: LED4.K 21.84,35.92 35.1,35.92 36.95,37.77 R11.1
N$12
  Bottom 0.61: R18.1 R19.1 R20.1 R21.1 39.4,54.5 39.9,54 40.65,54 41.05,53.6 Q1.2 41.05,51.35 41.88,50.52 R22.1 R23.1 44.73,50.55
N$13
  Bottom 0.61: R43.1 66.47,75.25 Q2.1
N$15  (via drill 0.5)
  Top 0.406: v38.65,88.85 39.25,89.45 47.42,89.45 v50.42,92.45
  Bottom 0.254: U$12.9 40.1,88.83 C8.1
  Bottom 0.406: v50.42,92.45 50.42,94.39 Q5.1 | v38.65,88.85 38.67,88.88 C8.1
N$16
  Bottom 0.254: T5.1 T7.1
N$17
  Bottom 0.61: Q2.3 70.28,75.6 U$8.+
N$19
  Bottom 0.254: U$12.17 C24.2
  Bottom 0.406: C24.2 40.77,96.78 46.02,96.78 47.33,95.47 Q5.4
N$20
  Bottom 0.61: R24.1 Q1.1
N$21
  Bottom 0.254: R26.1 69.33,93.03 70.08,92.28 70.08,90.9 69.35,90.17 U$1.6
N$22
  Bottom 0.61: LED5.K 25.67,37.1 33.67,37.1 35,38.42 R12.1
N$23
  Bottom 0.254: C26.2 38.51,92.87 U$12.16
N$24
  Bottom 0.61: R28.1 28.67,40 LED6.K
N$25
  Bottom 0.254: C27.2 37.6,92.35 U$12.15
N$26
  Bottom 0.254: U$12.4 42.48,91.35 42.8,91.67 42.8,94.83 ANTENNA.MP
  Bottom 0.406: L3.2 43.23,95.45 ANTENNA.MP
N$27
  Bottom 0.254: U$1.5 68.17,90.67 R26.2
N$28
  Bottom 0.254: T7.2 23.18,57.33 T5.3 R35.1 18.57,57.08 C21.1
N$29
  Bottom 0.254: U$12.6 43.1,88.85 R32.2
N$30
  Bottom 0.61: D5.A 30.89,89.72 27.73,86.55 R39.1
N$31
  Bottom 0.254: U$13.4 30.15,74.33 29.98,74.5 28.45,74.5 C32.1
N$32
  Bottom 0.254: R38.1 18.6,49.77 18.6,50.62 | 18.6,50.62 18.6,52.7 | T6.1 18.6,50.62
  Bottom 0.61: C21.2 18.6,52.7
N$33
  Bottom 0.254: U$1.10 67.72,88.17 Q4.1
P_CLK
  Bottom 0.305: X5.12 42.65,76.5 39.92,73.78 R16.2
PWM
  Bottom 0.61: R25.2 R24.2 37.35,45.99 U$11.P$33
RANDOM
  Bottom 0.406: T6.3 23.77,50.58 R41.1 26.07,50.58 27.2,49.45 29.4,49.45 30.6,48.25 30.99,47.86 31.83,47.02 U$11.P$37
RANDOM_POWER  (via drill 0.5)
  Top 0.406: U$11.P$40 28.24,43.01 27.23,44.02 27.23,47.3 18.73,55.8 v18.73,65.03
  Bottom 0.254: U$11.P$40 27.98,44.33 27.98,46.62 25.73,48.88 R41.2 R38.2
  Bottom 0.406: U$2.1 18.73,65.9 | 18.73,65.9 v18.73,65.03 | C35.1 18.73,65.9
ROW0  (via drill 0.5)
  Top 0.254: 7.85,11.35 arc90 8.4,11.9 8.4,12.65 arc90 Z.OUT Z.OUT arc-90 6.4,14.64 | 9.2,7.75 10.12,7.75 SHILFT-LEFT.OUT | 1.OUT 1.OUT arc90 4.5,34.6 arc90 6.45,32.65 6.58,32.77 7.1,32.77 7.4,33.08 v10.07,33.08 | 6.45,28.3 arc-90 Q.OUT 6.34,28.29 arc90 4.45,26.4 4.45,26.3 arc90 6.4,24.35 | 6.4,21.48 arc90 A.OUT 6.3,21.45 arc90 4.4,19.55 4.4,19.4 arc90 6.4,17.4
  Top 0.61: 6.45,32.65 6.43,32.63 Q.OUT | 6.4,24.35 6.43,24.32 A.OUT | 6.4,17.4 6.43,17.36 Z.OUT | 9.2,7.75 7.85,9.1 7.85,11.35
  Bottom 0.254: U$7.15 12.78,30.38 v10.07,33.08
ROW1  (via drill 0.5)
  Top 0.254: 2.OUT 13.73,36.53 arc90 11.85,34.65 11.85,34.55 arc90 13.85,32.55 | W.OUT arc90 W.OUT 13.74,28.29 arc90 11.85,26.4 11.85,26.35 arc90 13.9,24.3 | 13.9,21.5 arc-90 S.OUT 13.75,21.45 arc90 11.85,19.55 11.85,19.45 arc90 13.85,17.45 | X.OUT arc90 X.OUT | v17.38,33 14.9,33 14.57,32.67 13.98,32.67 13.86,32.55
  Top 0.61: 13.9,24.3 13.86,24.25 S.OUT | 13.85,32.55 13.86,32.55 W.OUT | 13.85,17.45 13.86,17.45 X.OUT
  Bottom 0.254: U$7.16 19.5,30.88 v17.38,33
ROW2  (via drill 0.5)
  Top 0.254: 21.25,10.65 arc90 23.2,12.6 23.2,12.75 arc90 21.34,14.61 C.OUT arc90 21.3,14.64 | 21.3,17.55 arc-90 19.3,19.55 arc-90 21.2,21.45 D.OUT arc-90 21.25,21.46 | 21.25,24.3 arc-90 19.25,26.3 19.25,26.4 arc-90 21.14,28.29 E.OUT arc-90 21.25,28.3 | 3.OUT 21.18,36.53 arc90 19.3,34.65 19.3,34.5 arc90 21.25,32.55 | v24.88,33.17 22.35,33.17 22.05,32.88 21.61,32.88 21.27,32.53
  Top 0.61: 21.25,32.55 21.27,32.53 E.OUT | 21.25,24.3 21.27,24.29 D.OUT | 21.3,17.55 21.27,17.52 C.OUT | SPACE1.OUT 21.25,9.02 21.25,10.65
  Bottom 0.254: U$7.17 26.68,31.38 v24.88,33.17
ROW3  (via drill 0.5)
  Top 0.254: 4.OUT 28.53,36.53 arc90 26.65,34.65 arc90 28.7,32.6 28.7,32.35 29.15,32.8 29.52,32.8 30.07,33.35 v31.3,33.33 | 28.7,28.32 arc-90 R.OUT 28.59,28.29 arc90 26.7,26.4 26.7,26.2 arc90 28.65,24.25 | 28.65,21.48 arc90 F.OUT 28.6,21.45 arc90 26.7,19.55 26.7,19.45 arc90 28.65,17.5 | 28.65,14.63 arc90 V.OUT 28.79,14.61 arc-90 30.7,12.7 30.7,12.05 arc-90 30,11.35 | 31.55,7.75 32.37,7.75 SPACE2.OUT
  Top 0.61: 28.7,32.35 28.68,32.33 R.OUT | 28.65,17.5 28.68,17.48 V.OUT | 28.65,24.25 28.68,24.23 F.OUT | 31.55,7.75 30,9.3 30,11.35
  Bottom 0.254: v31.3,33.33 32.77,31.85 U$7.18
ROW4  (via drill 0.5)
  Top 0.254: 36.2,17.5 arc-90 34.25,19.45 34.25,19.55 arc-90 36.15,21.45 G.OUT arc90 G.OUT | B.OUT arc-90 B.OUT | 36.2,24.35 arc-90 34.3,26.25 34.3,26.4 arc-90 T.OUT T.OUT arc90 T.OUT | 36.17,36.55 5.OUT 36.03,36.53 arc90 34.15,34.65 34.15,34.55 arc90 36.2,32.5 36.5,32.8 37.12,32.8 37.9,33.58 v39.9,33.58
  Top 0.61: 36.2,32.5 36.2,32.49 T.OUT | 36.2,24.35 36.2,24.34 G.OUT | 36.2,17.5 B.OUT
  Bottom 0.254: v39.9,33.58 41.1,32.38 U$7.19
ROW5  (via drill 0.5)
  Top 0.254: Y.OUT arc90 Y.OUT 43.49,28.29 arc90 41.6,26.4 41.6,26.3 arc90 43.5,24.4 | H.OUT arc90 H.OUT 43.4,21.45 arc90 41.45,19.5 41.45,19.45 arc90 43.5,17.4 | N.OUT arc90 N.OUT 43.41,14.61 arc90 41.5,12.7 41.5,12.2 arc90 42.75,10.95 | 6.OUT 43.48,36.53 arc90 41.55,34.6 41.55,34.45 arc90 43.5,32.5 43.6,32.6 44.08,32.6 45.12,33.65 v45.77,33.65
  Top 0.61: 43.5,32.5 43.51,32.49 Y.OUT | 43.5,24.4 43.51,24.39 H.OUT | 43.5,17.4 43.51,17.39 N.OUT | SPACE3.OUT 42.27,10.46 42.75,10.95
  Bottom 0.254: U$7.20 46.55,32.88 v45.77,33.65
ROW6  (via drill 0.5)
  Top 0.254: 52.35,11.25 arc90 53,11.9 53,12.7 arc90 51.09,14.61 M.OUT arc-90 50.95,14.62 | 53.65,7.75 54.6,7.75 SHIFT-RIGHT.OUT | 50.95,17.5 arc-90 48.9,19.55 48.9,19.6 arc-90 50.75,21.45 J.OUT arc-90 50.95,21.46 | 50.95,24.4 arc-90 49,26.35 49,26.4 arc-90 50.89,28.29 U.OUT arc90 51,28.32 | 51.45,32.95 51,32.5 arc-90 49,34.5 49,34.6 arc-90 50.93,36.53 7.OUT 50.95,36.55
  Top 0.406: 7.OUT 54.26,39.83 74.35,39.83 v74.58,40.05
  Top 0.61: 51,32.5 50.97,32.47 U.OUT | 50.95,24.4 50.97,24.39 J.OUT | 50.95,17.5 50.97,17.48 M.OUT | 53.65,7.75 52.35,9.05 52.35,11.25
  Bottom 0.254: v74.58,40.05 74.58,37.3 77.65,34.23 U$7.21
ROW7  (via drill 0.5)
  Top 0.254: 8.OUT 58.23,36.53 arc90 56.3,34.6 56.3,34.5 arc90 58.3,32.5 58.8,32.5 59.4,33.1 | 58.3,28.32 arc90 I.OUT 58.19,28.29 arc90 56.3,26.4 arc90 58.35,24.35 | 58.35,21.48 arc-90 K.OUT 58.3,21.45 arc90 56.4,19.55 56.4,19.35 arc90 58.3,17.45 | 58.3,14.63 arc90 ?.OUT
  Top 0.305: 8.OUT 60.62,38.83 75.28,38.83 v76.15,39.7
  Top 0.61: 58.3,32.5 58.33,32.48 I.OUT | 58.35,24.35 58.33,24.32 K.OUT | 58.3,14.63 58.3,17.45
  Bottom 0.254: v76.15,39.7 76.03,39.7 75.1,38.77 75.1,37.6 78.15,34.55 U$7.22
ROW8  (via drill 0.5)
  Top 0.254: 65.75,10.65 arc-90 63.7,12.7 arc-90 65.61,14.61 !.OUT arc-90 65.7,14.64 | 65.75,7.79 arc-90 @.OUT | 65.58,36.67 9.OUT
  Top 0.305: 9.OUT 67.06,37.85 v76.05,37.85
  Top 0.61: 65.75,7.79 65.75,10.65 | 65.7,14.64 65.7,17.57 arc-90 63.8,19.48 63.8,19.6 arc-90 65.65,21.45 L.OUT arc90 65.75,21.46 65.75,24.35 arc-90 63.75,26.35 63.75,26.55 arc-90 65.49,28.29 O.OUT arc-90 O.OUT 65.72,32.65 arc-90 63.77,34.6 63.77,34.67 arc-90 65.63,36.53 9.OUT arc-90 9.OUT
  Bottom 0.254: v76.05,37.85 76.05,37.35 78.65,34.75 U$7.23
ROW9  (via drill 0.5)
  Top 0.254: 73.2,17.5 arc-90 71.2,19.5 71.2,19.55 arc-90 73.1,21.45 (.OUT arc-90 (.OUT | 73.2,14.65 arc-90 ,.OUT 73.34,14.61 arc-90 75.2,12.75 75.2,12.05 arc-90 74.45,11.3 | 76,7.8 76.83,7.8 FN-RIGHT.OUT | 73.16,24.34 73.15,24.35 arc-90 71.15,26.35 71.15,26.4 arc-90 73.04,28.29 P.OUT | 73.17,32.62 arc-90 71.25,34.55 71.25,34.7 arc-90 73.08,36.53 10.OUT 73.92,36.53 74.58,35.85 76.08,35.85 v77.67,37.45
  Top 0.406: P.OUT arc90 73.17,28.31 73.17,32.62
  Top 0.61: 73.16,24.34 (.OUT | 73.2,17.5 73.16,17.45 ,.OUT | 76,7.8 74.45,9.35 74.45,11.3
  Bottom 0.254: v77.67,37.45 79.17,35.95 U$7.24
ROW10  (via drill 0.5)
  Top 0.254: 80.56,17.56 80.53,17.6 arc-90 78.6,19.52 78.6,19.65 arc-90 80.4,21.45 ).OUT | 80.58,24.38 arc-90 78.65,26.3 78.65,26.43 arc-90 80.52,28.29 12.OUT 81.88,29.6 81.88,31.65 80.8,32.73 | 80.8,32.73 80.55,32.73 arc90 82.45,34.62 82.45,34.75 arc90 80.67,36.53 11.OUT 80.55,36.97 v79.1,38.42 | 80.8,32.73 81.17,32.73
  Top 0.406: 12.OUT arc-90 80.55,28.3
  Top 0.61: ..OUT 80.56,17.56 | ).OUT arc90 80.58,21.46 80.58,24.38
  Bottom 0.254: U$7.25 79.65,37.88 v79.1,38.42
SCK
  Bottom 0.305: X5.36 48.38,64.5 51.7,61.17 51.7,47.64 U$11.P$23
SCL_3V3  (via drill 0.5, 0.6)
  Top 0.406: v62.17,36.92 62.17,27.82 v62,27.65 | v63.83,41.27 70.08,41.27 71.2,42.4 71.2,44.28 U$11.P$5 72.47,48.8 71.22,50.05 60.62,50.05 59.27,51.4 44.08,51.4 v33.4,62.08 31.68,63.8 v31.68,72.83 31.68,82.38 35.52,86.22 v41.3,86.22
  Bottom 0.2: U$13.2 30.95,73.28 31.23,73 31.6,73 | 31.6,73 32.05,73 33.05,74 R34.1 | v31.68,72.83 31.68,72.92 31.6,73
  Bottom 0.254: 72.45,45.57 U$11.P$5 | U$7.11 62.73,28.38 v62,27.65 | U$12.7 41.1,86.42 v41.3,86.22 | U$6.12 34.52,64.28 34.75,64.05 34.75,63.42 v33.4,62.08
  Bottom 0.305: U$6.12 34.52,66.05 R6.1
  Bottom 0.406: v63.83,41.27 62.17,39.62 v62.17,36.92 | U$11.P$5 72.9,45.8 74.83,47.73 U$5.6 74.83,50.84 75.1,51.1 77.9,51.1 R1.1
SDA_3V3  (via drill 0.5)
  Top 0.406: 72.17,41.1 v71.95,41.1 73.08,41.1 73.75,41.77 73.75,44.29 U$11.P$3 | v69.42,36.33 69.47,36.27 v69.47,27.38 | 74.95,45.6 U$11.P$3 | U$11.P$3 74.3,46.26 74.3,48.62 71.83,51.1 61.23,51.1 59.65,52.67 44.98,52.67 v33.88,63.77 33.33,64.33 v33.33,77.7 33.33,81.4 36.9,84.97 v40.6,84.97
  Bottom 0.2: U$13.10 31.35,76.92 31.52,77.1 R33.1
  Bottom 0.254: v40.6,84.97 U$12.8 | U$6.11 v33.88,63.77
  Bottom 0.305: U$7.10 69.72,27.62 v69.47,27.38 | U$6.11 33.88,66.05 R2.1
  Bottom 0.406: v71.95,41.1 69.42,38.58 v69.42,36.33 | R33.1 32.12,77.7 v33.33,77.7 | R3.1 76.11,48.67 | U$5.5 76.11,48.67 | 76.11,48.67 76.11,46.65 U$11.P$3
SW
  Bottom 0.254: U$1.20 63.25,91.67 62.73,92.12
  pour Bottom (isolate 0.254): 64.03,91.2 63.1,91.22 62.25,92.08 59.83,92.1 59.55,91.75 59.25,91.35 54.1,91.35 54.1,94 56.25,94 62.4,94.03 62.95,93.5 62.95,92.58
TOUCH_X+  (via drill 0.5)
  Top 0.406: v38.2,61.5 38.2,63.4 v38.95,64.17
  Bottom 0.254: X5.39 44.27,63 43.33,63.95 39.17,63.95 v38.95,64.17
  Bottom 0.305: C2.2 36.48,56.9 U$6.2 36.48,61.1 36.88,61.5 v38.2,61.5
TOUCH_X-
  Bottom 0.254: X5.41 43.92,62 43.08,62.85 36.38,62.85 35.17,61.65 U$6.4 35.17,58.2 C18.2
TOUCH_Y+
  Bottom 0.254: X5.42 43.75,61.5 42.9,62.35 36.6,62.35 35.83,61.58 U$6.3 35.83,57.42 C3.2
TOUCH_Y-
  Bottom 0.254: X5.40 44.1,62.5 43.25,63.35 36.2,63.35 34.52,61.67 U$6.5 34.52,58.35 33.8,57.62 33.17,57.62 C4.2
V+
  Bottom 0.406: U$5.8 70.47,47.33 64.05,47.33 62.85,48.52 62.85,51.15 61.07,52.93 IC2.8 55.2,52.93 54.9,52.62 54.9,52.15 R4.2 R5.2 54.78,48.99 57.23,46.55 U$11.P$17
V_SYNC
  Bottom 0.305: X5.10 40.3,77.5 R14.1
VBAT+
  Bottom 0.406: U$5.3 74.83,52.64 75.3,52.17 76.85,52.17 77.85,53.17 77.85,57.35 U$4.+
VCC  (via drill 0.5)
  Top 0.406: 77.83,45.55 U$11.P$1 79.42,45.55 79.78,45.2 79.78,39.85 83.97,35.67 83.97,27.18 v83.85,27.05
  Bottom 0.254: U$7.38 83.62,29.38 83.85,29.15 83.85,28.85 | 83.85,28.85 v83.85,27.05 | U$7.39 82.92,28.85 83.85,28.85
  Bottom 0.406: R1.2 R3.2 79.53,47.5 U$11.P$1